# EAGLE schematic power-board (EAGLE 6.6.0)

## Sheet 1 of 18: Headers H1, H2, Solar Panels and Umbilical Connection
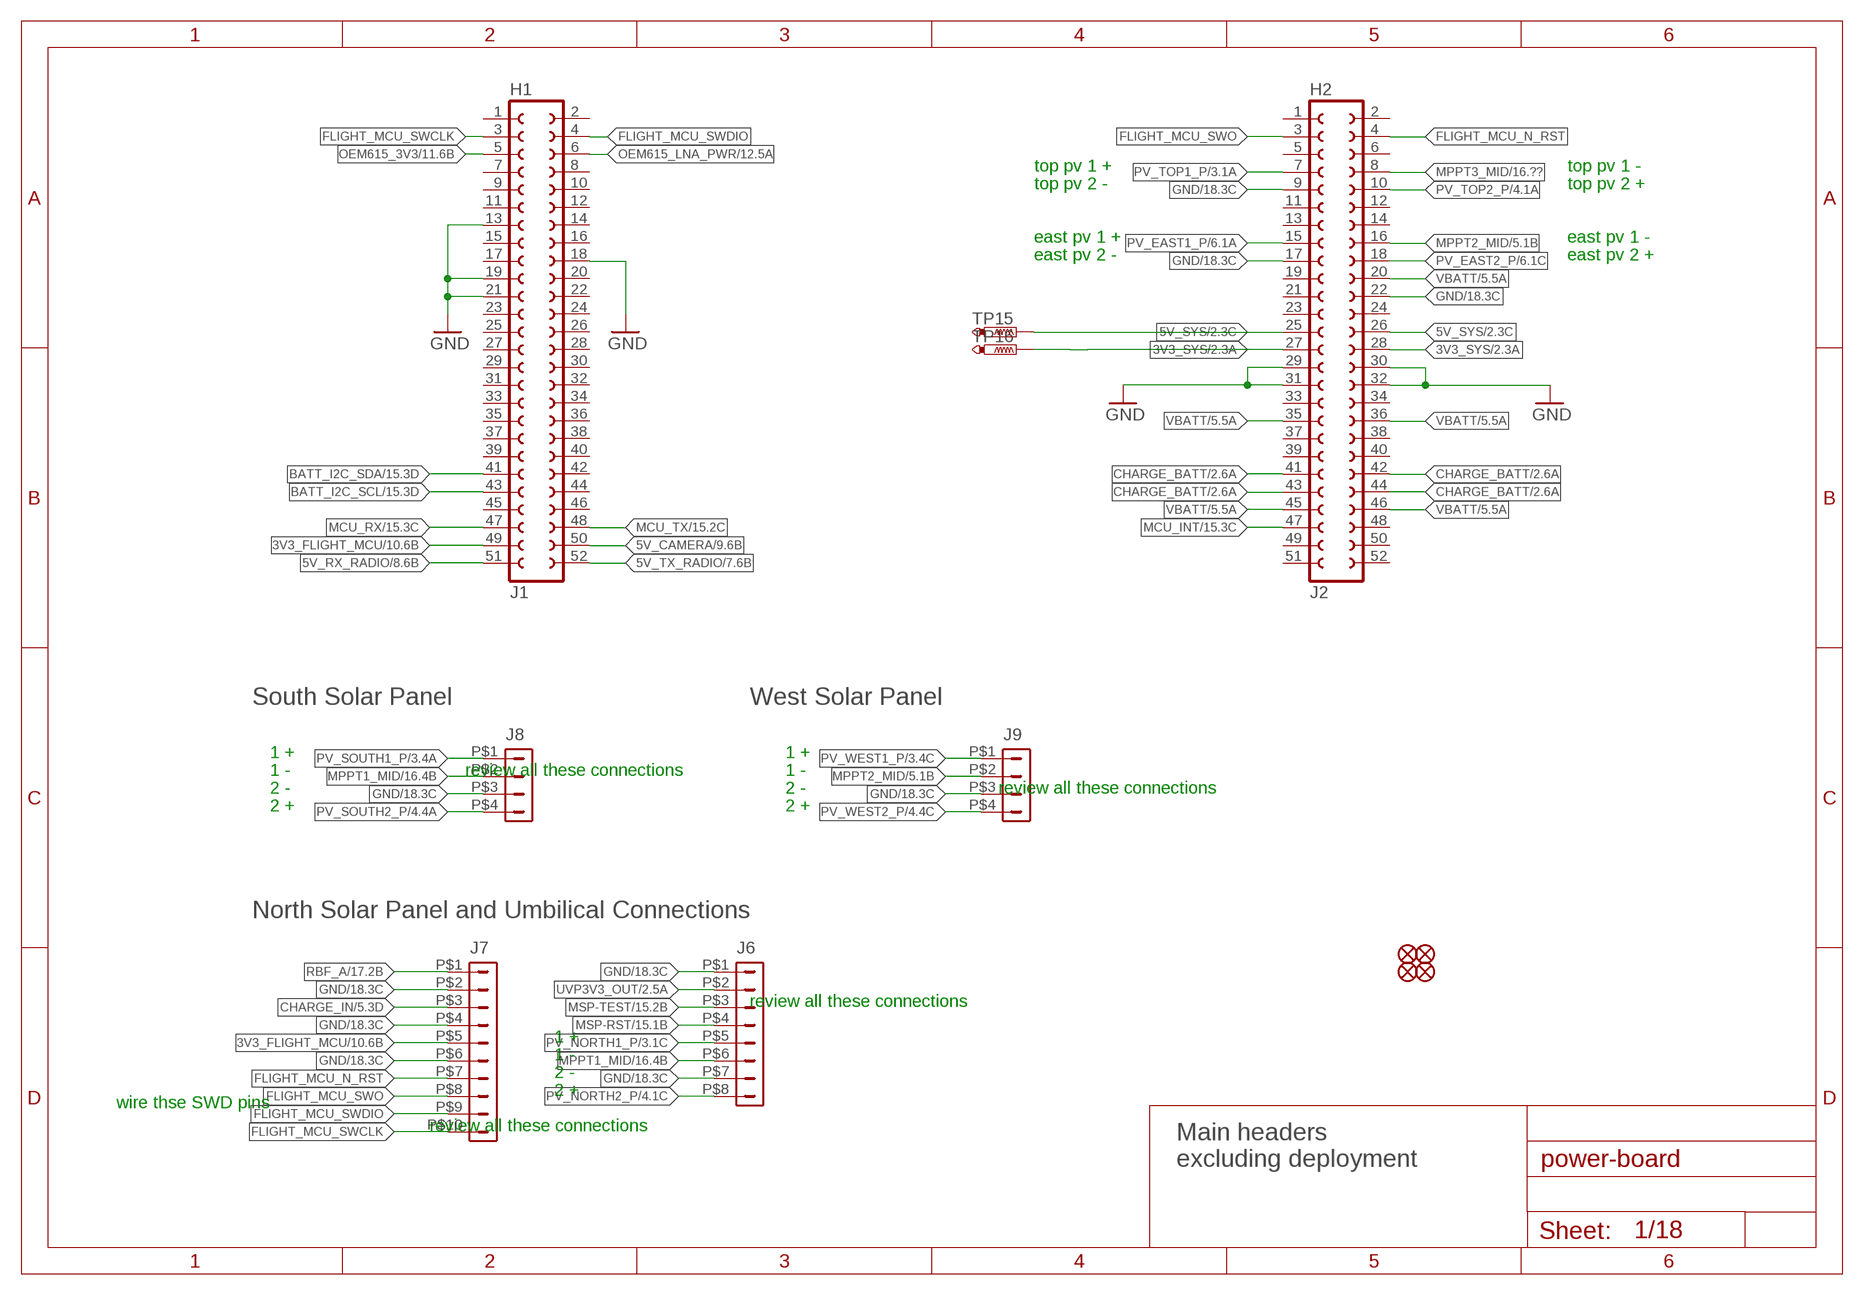
[diagram p0: schematic, sheet 1]

### Parts
FID1  FIDUCIAL1X2-STOP  [FIDUCIAL-1X2-STOP]
FID2  FIDUCIAL1X2-STOP  [FIDUCIAL-1X2-STOP]
FID3  FIDUCIAL1X2-STOP  [FIDUCIAL-1X2-STOP]
FID4  FIDUCIAL1X2-STOP  [FIDUCIAL-1X2-STOP]
J1  H1  FE26-2  [FE26-2]
J2  H2  FE26-2  [FE26-2]
J6  DF13-8P-1.25DS  [DF13-8P-1.25DS]
J7  DF13-10P-1.25DS  [DF13-10P-1.25DS]
J8  DF13-4P-1.25DS  [DF13-4P-1.25DS]
J9  DF13-4P-1.25DS  [DF13-4P-1.25DS]
TP15  PTR1TP09R  [TP09R]
TP16  PTR1TP09R  [TP09R]

### Nets
3V3_FLIGHT_MCU: J1.49 J7.P$5 ; also sheet 10
3V3_SYS: J2.27 J2.28 TP16.TP ; also sheet 2
5V_CAMERA: J1.50 ; also sheet 9
5V_RX_RADIO: J1.51 ; also sheet 8
5V_SYS: J2.25 J2.26 TP15.TP ; also sheet 2
5V_TX_RADIO: J1.52 ; also sheet 7
BATT_I2C_SCL: J1.43 ; also sheet 15
BATT_I2C_SDA: J1.41 ; also sheet 15
CHARGE_BATT: J2.41 J2.42 J2.43 J2.44 ; also sheet 2,18
CHARGE_IN: J7.P$3 ; also sheet 5,16,17,18
FLIGHT_MCU_N_RST: J2.4 J7.P$7
FLIGHT_MCU_SWCLK: J1.3 J7.P$10
FLIGHT_MCU_SWDIO: J1.4 J7.P$9
FLIGHT_MCU_SWO: J2.3 J7.P$8
GND: J1.13 J1.18 J1.19 J1.21 J2.9 J2.17 J2.22 J2.29 J2.30 J2.31 J2.32 J6.P$1 J6.P$7 J7.P$2 J7.P$4 J7.P$6 J8.P$3 J9.P$3 ; also sheet 2,3,4,5,6,7,8,9,10,11,12,13,14,15,16,18
MCU_INT: J2.47 ; also sheet 15
MCU_RX: J1.47 ; also sheet 15
MCU_TX: J1.48 ; also sheet 15
MPPT1_MID: J6.P$6 J8.P$2 ; also sheet 16
MPPT2_MID: J2.16 J9.P$2 ; also sheet 5,16
MPPT3_MID: J2.8 ; also sheet 16
MSP-RST: J6.P$4 ; also sheet 15
MSP-TEST: J6.P$3 ; also sheet 15
OEM615_3V3: J1.5 ; also sheet 11
OEM615_LNA_PWR: J1.6 ; also sheet 12
PV_EAST1_P: J2.15 ; also sheet 6
PV_EAST2_P: J2.18 ; also sheet 6
PV_NORTH1_P: J6.P$5 ; also sheet 3
PV_NORTH2_P: J6.P$8 ; also sheet 4
PV_SOUTH1_P: J8.P$1 ; also sheet 3
PV_SOUTH2_P: J8.P$4 ; also sheet 4
PV_TOP1_P: J2.7 ; also sheet 3
PV_TOP2_P: J2.10 ; also sheet 4
PV_WEST1_P: J9.P$1 ; also sheet 3
PV_WEST2_P: J9.P$4 ; also sheet 4
RBF_A: J7.P$1 ; also sheet 17
UVP3V3_OUT: J6.P$2 ; also sheet 2,3,4,5,6,7,8,9,10,11,12,13,15
VBATT: J2.20 J2.35 J2.36 J2.45 J2.46 ; also sheet 5,7,8,9,10,11,12,13,14,17
Unconnected: J1.1 J1.2 J1.7 J1.8 J1.9 J1.10 J1.11 J1.12 J1.14 J1.15 J1.16 J1.17 J1.20 J1.22 J1.23 J1.24 J1.25 J1.26 J1.27 J1.28 J1.29 J1.30 J1.31 J1.32 J1.33 J1.34 J1.35 J1.36 J1.37 J1.38 J1.39 J1.40 J1.42 J1.44 J1.45 J1.46 J2.1 J2.2 J2.5 J2.6 J2.11 J2.12 J2.13 J2.14 J2.19 J2.21 J2.23 J2.24 J2.33 J2.34 J2.37 J2.38 J2.39 J2.40 J2.48 J2.49 J2.50 J2.51 J2.52

### Notes on the sheet
- top pv 1 + | top pv 1 -
- top pv 2 - | top pv 2 +
- east pv 1 + | east pv 1 -
- east pv 2 - | east pv 2 +
- South Solar Panel | West Solar Panel
- 1 + | 1 +
- 1 - | review all these connections | 1 -
- 2 - | 2 - | review all these connections
- 2 + | 2 +
- North Solar Panel and Umbilical Connections
- review all these connections
- 1 +
- 1 -
- 2 -
- wire thse SWD pins | 2 +
- review all these connections
- Main headers
  excluding deployment

## Sheet 2 of 18: 3V3_SYS/5V_SYS/battery charge Current Sense
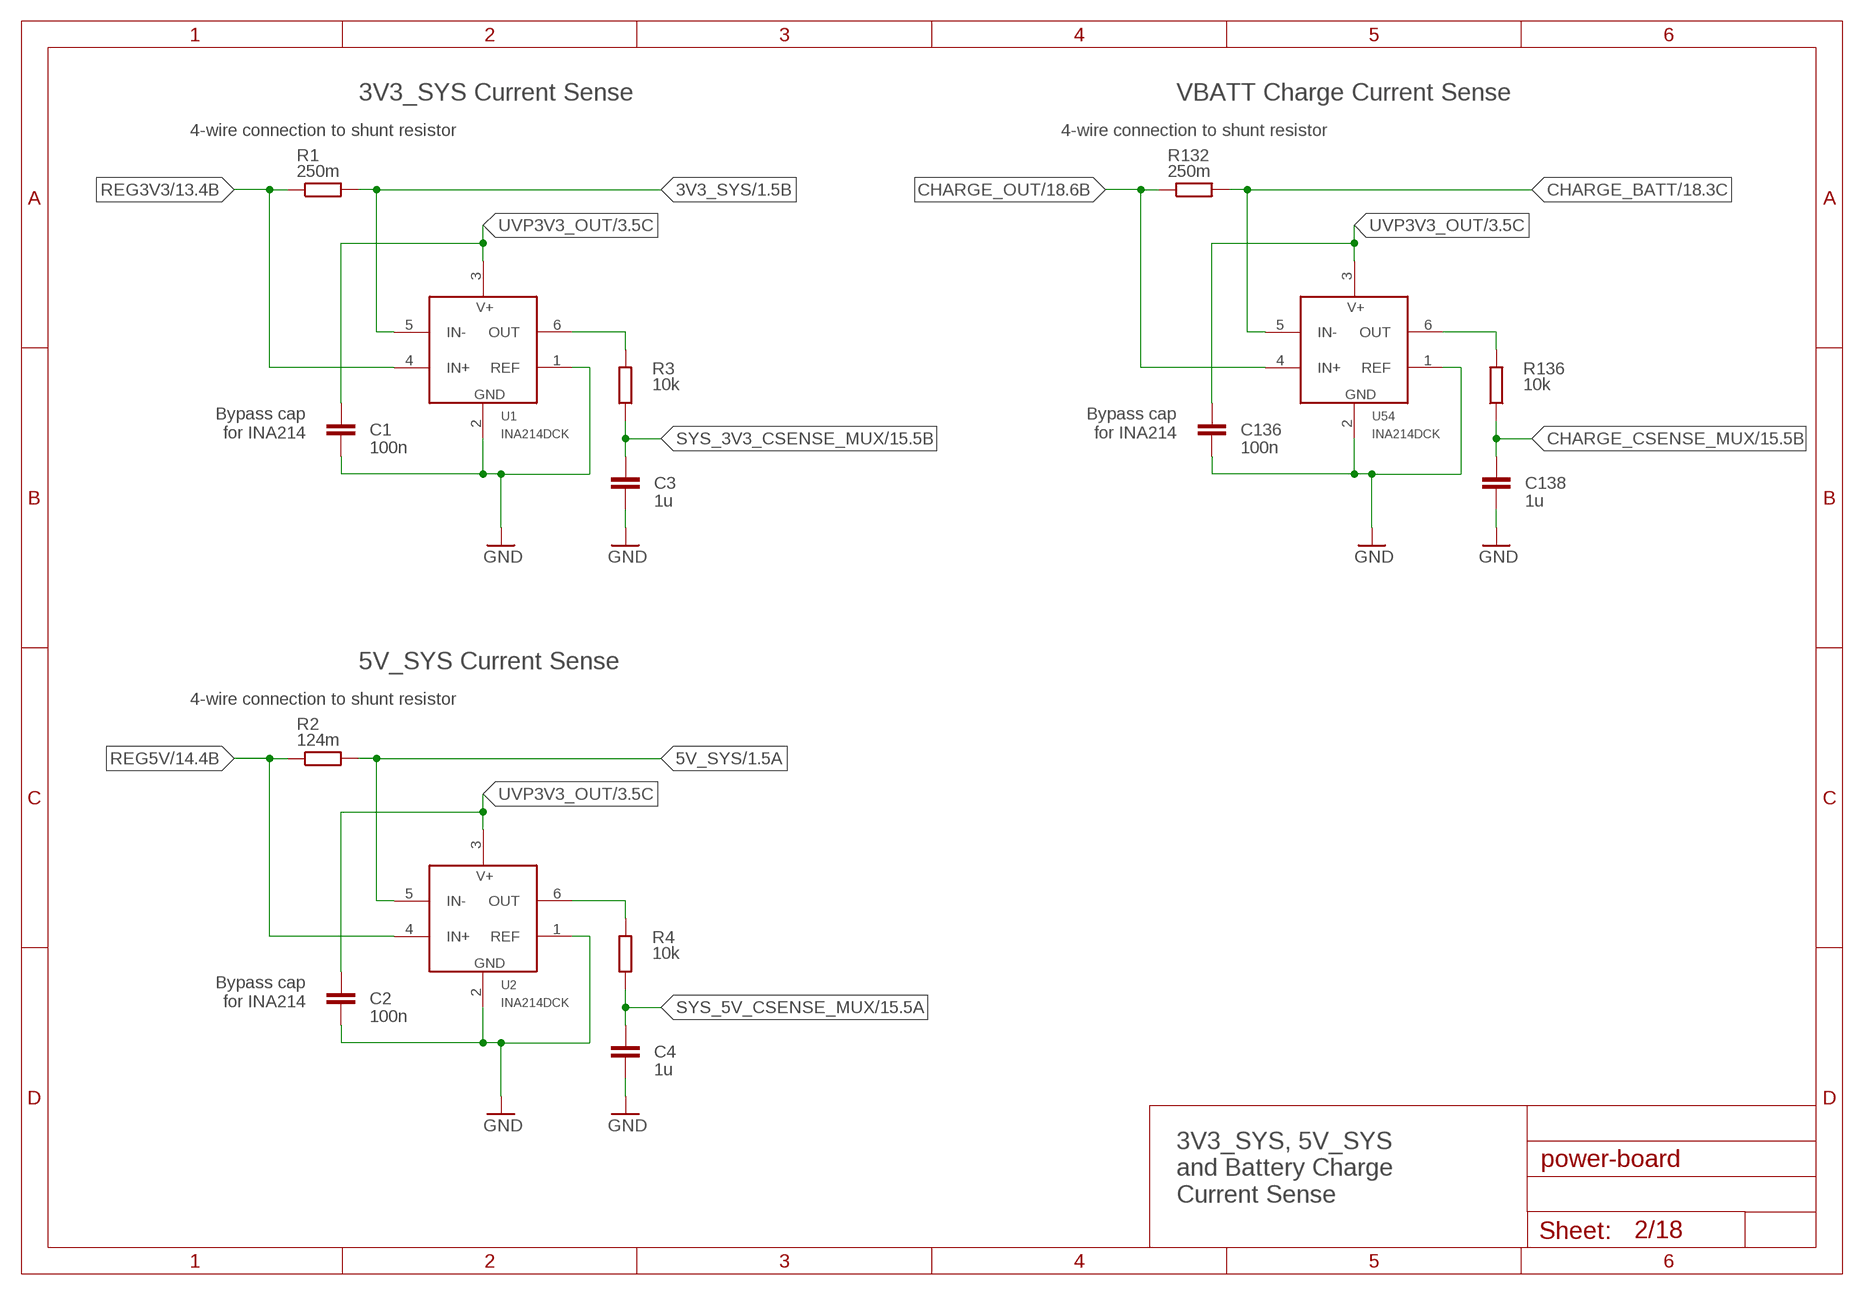
[diagram p1: schematic, sheet 2]

### Parts
C1  100n  C-EUC0603  [C0603]
C2  100n  C-EUC0603  [C0603]
C3  1u  C-EUC0603  [C0603]
C4  1u  C-EUC0603  [C0603]
C136  100n  C-EUC0603  [C0603]
C138  1u  C-EUC0603  [C0603]
R1  250m  R-EU_R1206  [R1206]
R2  124m  R-EU_R1206  [R1206]
R3  10k  R-EU_R0603  [R0603]
R4  10k  R-EU_R0603  [R0603]
R132  250m  R-EU_R1206  [R1206]
R136  10k  R-EU_R0603  [R0603]
U1  INA214DCK  [SC70-6]
U2  INA214DCK  [SC70-6]
U54  INA214DCK  [SC70-6]

### Nets
3V3_SYS: R1.2 U1.5(IN-) ; also sheet 1
5V_SYS: R2.2 U2.5(IN-) ; also sheet 1
CHARGE_BATT: R132.2 U54.5(IN-) ; also sheet 1,18
CHARGE_CSENSE_MUX: C138.1 R136.1 ; also sheet 15
CHARGE_OUT: R132.1 U54.4(IN+) ; also sheet 18
GND: C1.2 C2.2 C3.2 C4.2 C136.2 C138.2 U1.1(REF) U1.2(GND) U2.1(REF) U2.2(GND) U54.1(REF) U54.2(GND) ; also sheet 1,3,4,5,6,7,8,9,10,11,12,13,14,15,16,18
N$81: R3.2 U1.6(OUT)
N$240: R4.2 U2.6(OUT)
N$681: R136.2 U54.6(OUT)
REG3V3: R1.1 U1.4(IN+) ; also sheet 13,14
REG5V: R2.1 U2.4(IN+) ; also sheet 14
SYS_3V3_CSENSE_MUX: C3.1 R3.1 ; also sheet 15
SYS_5V_CSENSE_MUX: C4.1 R4.1 ; also sheet 15
UVP3V3_OUT: C1.1 C2.1 C136.1 U1.3(V+) U2.3(V+) U54.3(V+) ; also sheet 1,3,4,5,6,7,8,9,10,11,12,13,15

### Notes on the sheet
- 3V3_SYS Current Sense | VBATT Charge Current Sense
- 4-wire connection to shunt resistor | 4-wire connection to shunt resistor
- Bypass cap
  for INA214
- Bypass cap
  for INA214
- 5V_SYS Current Sense
- 4-wire connection to shunt resistor
- Bypass cap
  for INA214
- 3V3_SYS, 5V_SYS
  and Battery Charge
  Current Sense

## Sheet 3 of 18: Solar Panel 1 Current Measurements
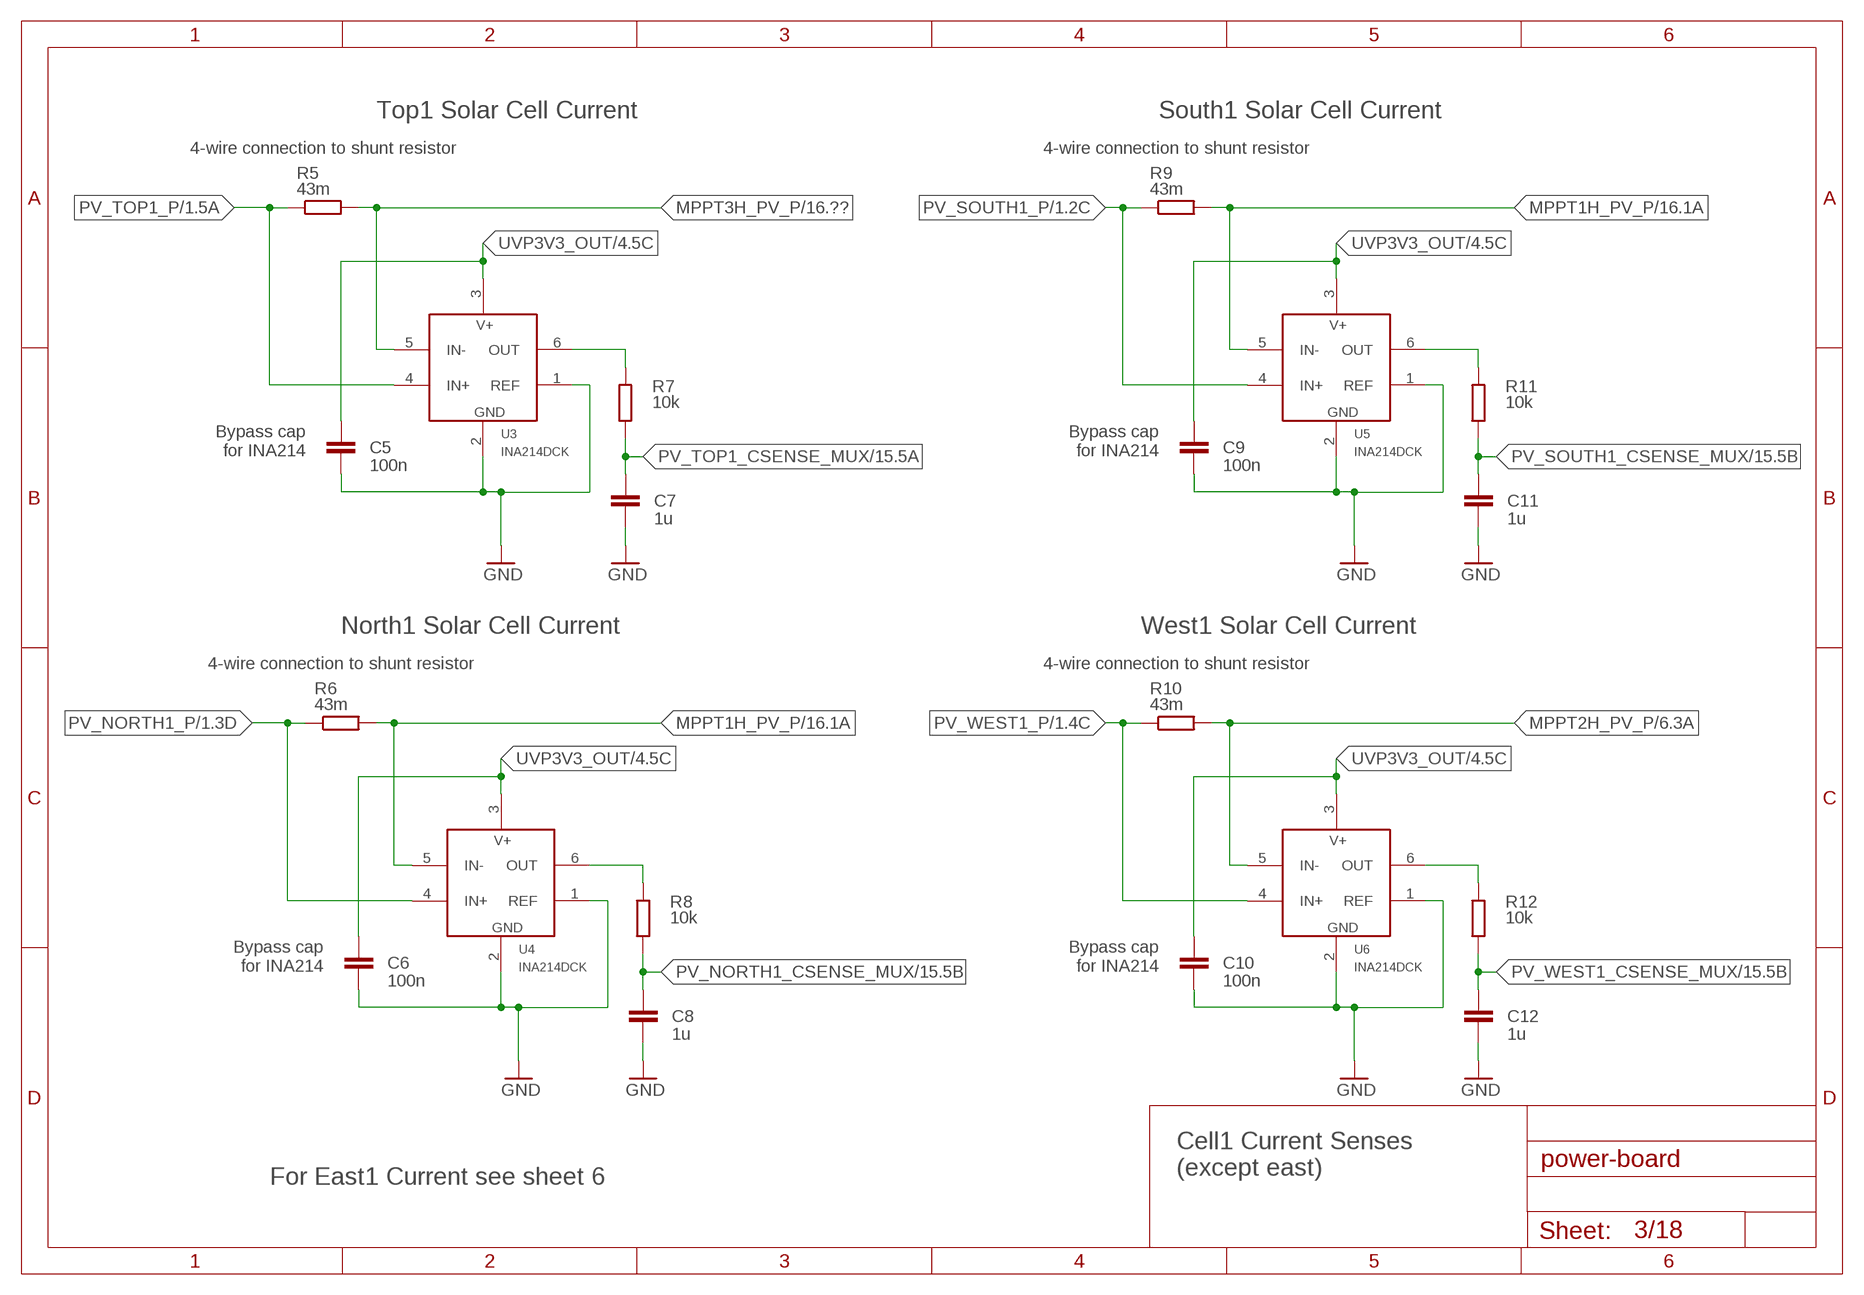
[diagram p2: schematic, sheet 3]

### Parts
C5  100n  C-EUC0603  [C0603]
C6  100n  C-EUC0603  [C0603]
C7  1u  C-EUC0603  [C0603]
C8  1u  C-EUC0603  [C0603]
C9  100n  C-EUC0603  [C0603]
C10  100n  C-EUC0603  [C0603]
C11  1u  C-EUC0603  [C0603]
C12  1u  C-EUC0603  [C0603]
R5  43m  R-EU_R1206  [R1206]
R6  43m  R-EU_R1206  [R1206]
R7  10k  R-EU_R0603  [R0603]
R8  10k  R-EU_R0603  [R0603]
R9  43m  R-EU_R1206  [R1206]
R10  43m  R-EU_R1206  [R1206]
R11  10k  R-EU_R0603  [R0603]
R12  10k  R-EU_R0603  [R0603]
U3  INA214DCK  [SC70-6]
U4  INA214DCK  [SC70-6]
U5  INA214DCK  [SC70-6]
U6  INA214DCK  [SC70-6]

### Nets
GND: C5.2 C6.2 C7.2 C8.2 C9.2 C10.2 C11.2 C12.2 U3.1(REF) U3.2(GND) U4.1(REF) U4.2(GND) U5.1(REF) U5.2(GND) U6.1(REF) U6.2(GND) ; also sheet 1,2,4,5,6,7,8,9,10,11,12,13,14,15,16,18
MPPT1H_PV_P: R6.2 R9.2 U4.5(IN-) U5.5(IN-) ; also sheet 16
MPPT2H_PV_P: R10.2 U6.5(IN-) ; also sheet 6,16
MPPT3H_PV_P: R5.2 U3.5(IN-) ; also sheet 16
N$93: R7.2 U3.6(OUT)
N$96: R11.2 U5.6(OUT)
N$279: R8.2 U4.6(OUT)
N$570: R12.2 U6.6(OUT)
PV_NORTH1_CSENSE_MUX: C8.1 R8.1 ; also sheet 15
PV_NORTH1_P: R6.1 U4.4(IN+) ; also sheet 1
PV_SOUTH1_CSENSE_MUX: C11.1 R11.1 ; also sheet 15
PV_SOUTH1_P: R9.1 U5.4(IN+) ; also sheet 1
PV_TOP1_CSENSE_MUX: C7.1 R7.1 ; also sheet 15
PV_TOP1_P: R5.1 U3.4(IN+) ; also sheet 1
PV_WEST1_CSENSE_MUX: C12.1 R12.1 ; also sheet 15
PV_WEST1_P: R10.1 U6.4(IN+) ; also sheet 1
UVP3V3_OUT: C5.1 C6.1 C9.1 C10.1 U3.3(V+) U4.3(V+) U5.3(V+) U6.3(V+) ; also sheet 1,2,4,5,6,7,8,9,10,11,12,13,15

### Notes on the sheet
- Top1 Solar Cell Current | South1 Solar Cell Current
- 4-wire connection to shunt resistor | 4-wire connection to shunt resistor
- Bypass cap
  for INA214
- Bypass cap
  for INA214
- North1 Solar Cell Current | West1 Solar Cell Current
- 4-wire connection to shunt resistor | 4-wire connection to shunt resistor
- Bypass cap
  for INA214
- Bypass cap
  for INA214
- Cell1 Current Senses
  (except east)
- For East1 Current see sheet 6

## Sheet 4 of 18: Solar Panel 2 Current Measurements
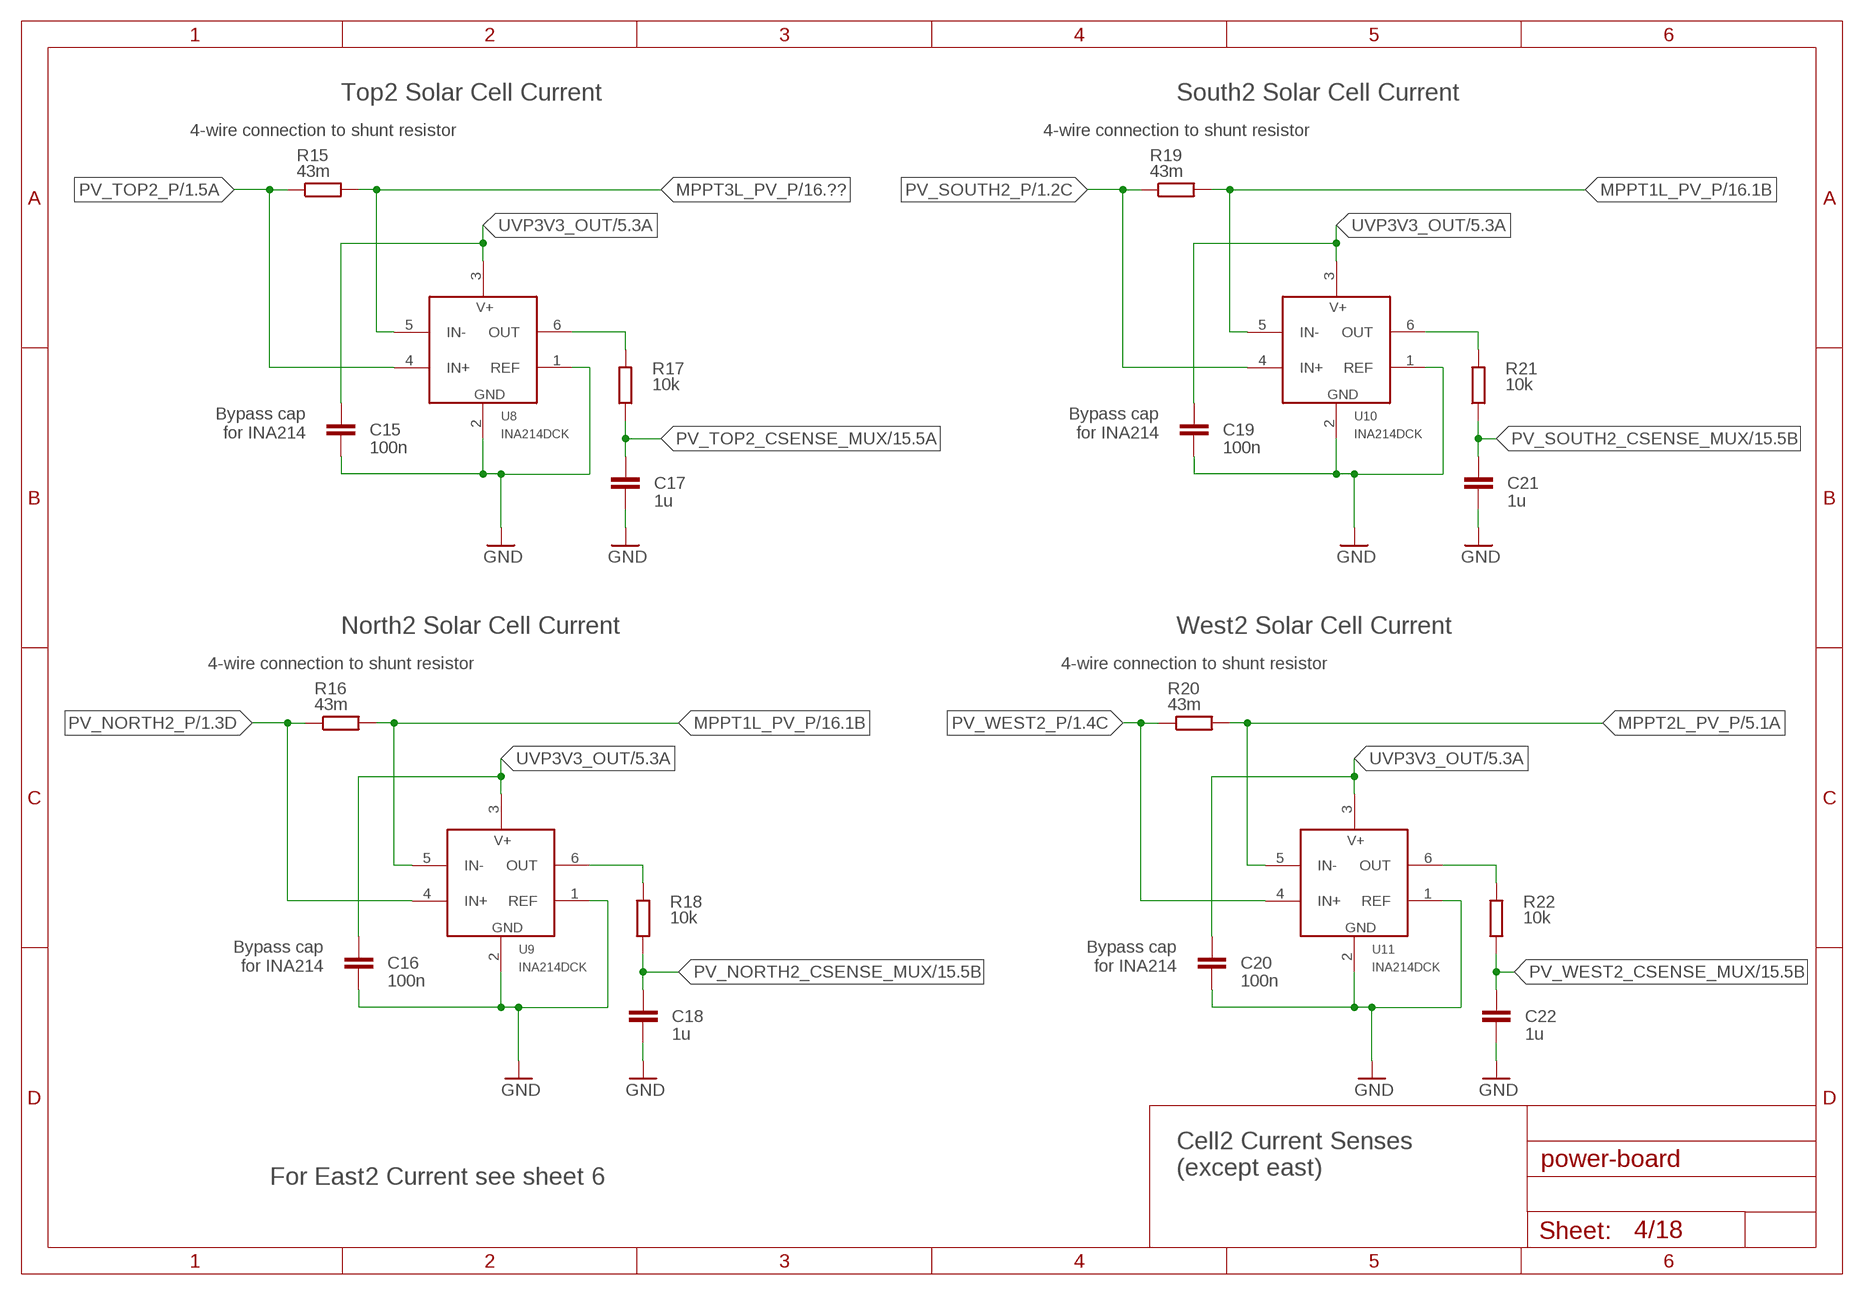
[diagram p3: schematic, sheet 4]

### Parts
C15  100n  C-EUC0603  [C0603]
C16  100n  C-EUC0603  [C0603]
C17  1u  C-EUC0603  [C0603]
C18  1u  C-EUC0603  [C0603]
C19  100n  C-EUC0603  [C0603]
C20  100n  C-EUC0603  [C0603]
C21  1u  C-EUC0603  [C0603]
C22  1u  C-EUC0603  [C0603]
R15  43m  R-EU_R1206  [R1206]
R16  43m  R-EU_R1206  [R1206]
R17  10k  R-EU_R0603  [R0603]
R18  10k  R-EU_R0603  [R0603]
R19  43m  R-EU_R1206  [R1206]
R20  43m  R-EU_R1206  [R1206]
R21  10k  R-EU_R0603  [R0603]
R22  10k  R-EU_R0603  [R0603]
U8  INA214DCK  [SC70-6]
U9  INA214DCK  [SC70-6]
U10  INA214DCK  [SC70-6]
U11  INA214DCK  [SC70-6]

### Nets
GND: C15.2 C16.2 C17.2 C18.2 C19.2 C20.2 C21.2 C22.2 U8.1(REF) U8.2(GND) U9.1(REF) U9.2(GND) U10.1(REF) U10.2(GND) U11.1(REF) U11.2(GND) ; also sheet 1,2,3,5,6,7,8,9,10,11,12,13,14,15,16,18
MPPT1L_PV_P: R16.2 R19.2 U9.5(IN-) U10.5(IN-) ; also sheet 16
MPPT2L_PV_P: R20.2 U11.5(IN-) ; also sheet 5,6,16
MPPT3L_PV_P: R15.2 U8.5(IN-) ; also sheet 16
N$15: R17.2 U8.6(OUT)
N$53: R21.2 U10.6(OUT)
N$644: R18.2 U9.6(OUT)
N$682: R22.2 U11.6(OUT)
PV_NORTH2_CSENSE_MUX: C18.1 R18.1 ; also sheet 15
PV_NORTH2_P: R16.1 U9.4(IN+) ; also sheet 1
PV_SOUTH2_CSENSE_MUX: C21.1 R21.1 ; also sheet 15
PV_SOUTH2_P: R19.1 U10.4(IN+) ; also sheet 1
PV_TOP2_CSENSE_MUX: C17.1 R17.1 ; also sheet 15
PV_TOP2_P: R15.1 U8.4(IN+) ; also sheet 1
PV_WEST2_CSENSE_MUX: C22.1 R22.1 ; also sheet 15
PV_WEST2_P: R20.1 U11.4(IN+) ; also sheet 1
UVP3V3_OUT: C15.1 C16.1 C19.1 C20.1 U8.3(V+) U9.3(V+) U10.3(V+) U11.3(V+) ; also sheet 1,2,3,5,6,7,8,9,10,11,12,13,15

### Notes on the sheet
- Top2 Solar Cell Current | South2 Solar Cell Current
- 4-wire connection to shunt resistor | 4-wire connection to shunt resistor
- Bypass cap
  for INA214
- Bypass cap
  for INA214
- North2 Solar Cell Current | West2 Solar Cell Current
- 4-wire connection to shunt resistor | 4-wire connection to shunt resistor
- Bypass cap
  for INA214
- Bypass cap
  for INA214
- Cell2 Current Senses
  (except east)
- For East2 Current see sheet 6

## Sheet 5 of 18: Voltage Measurements
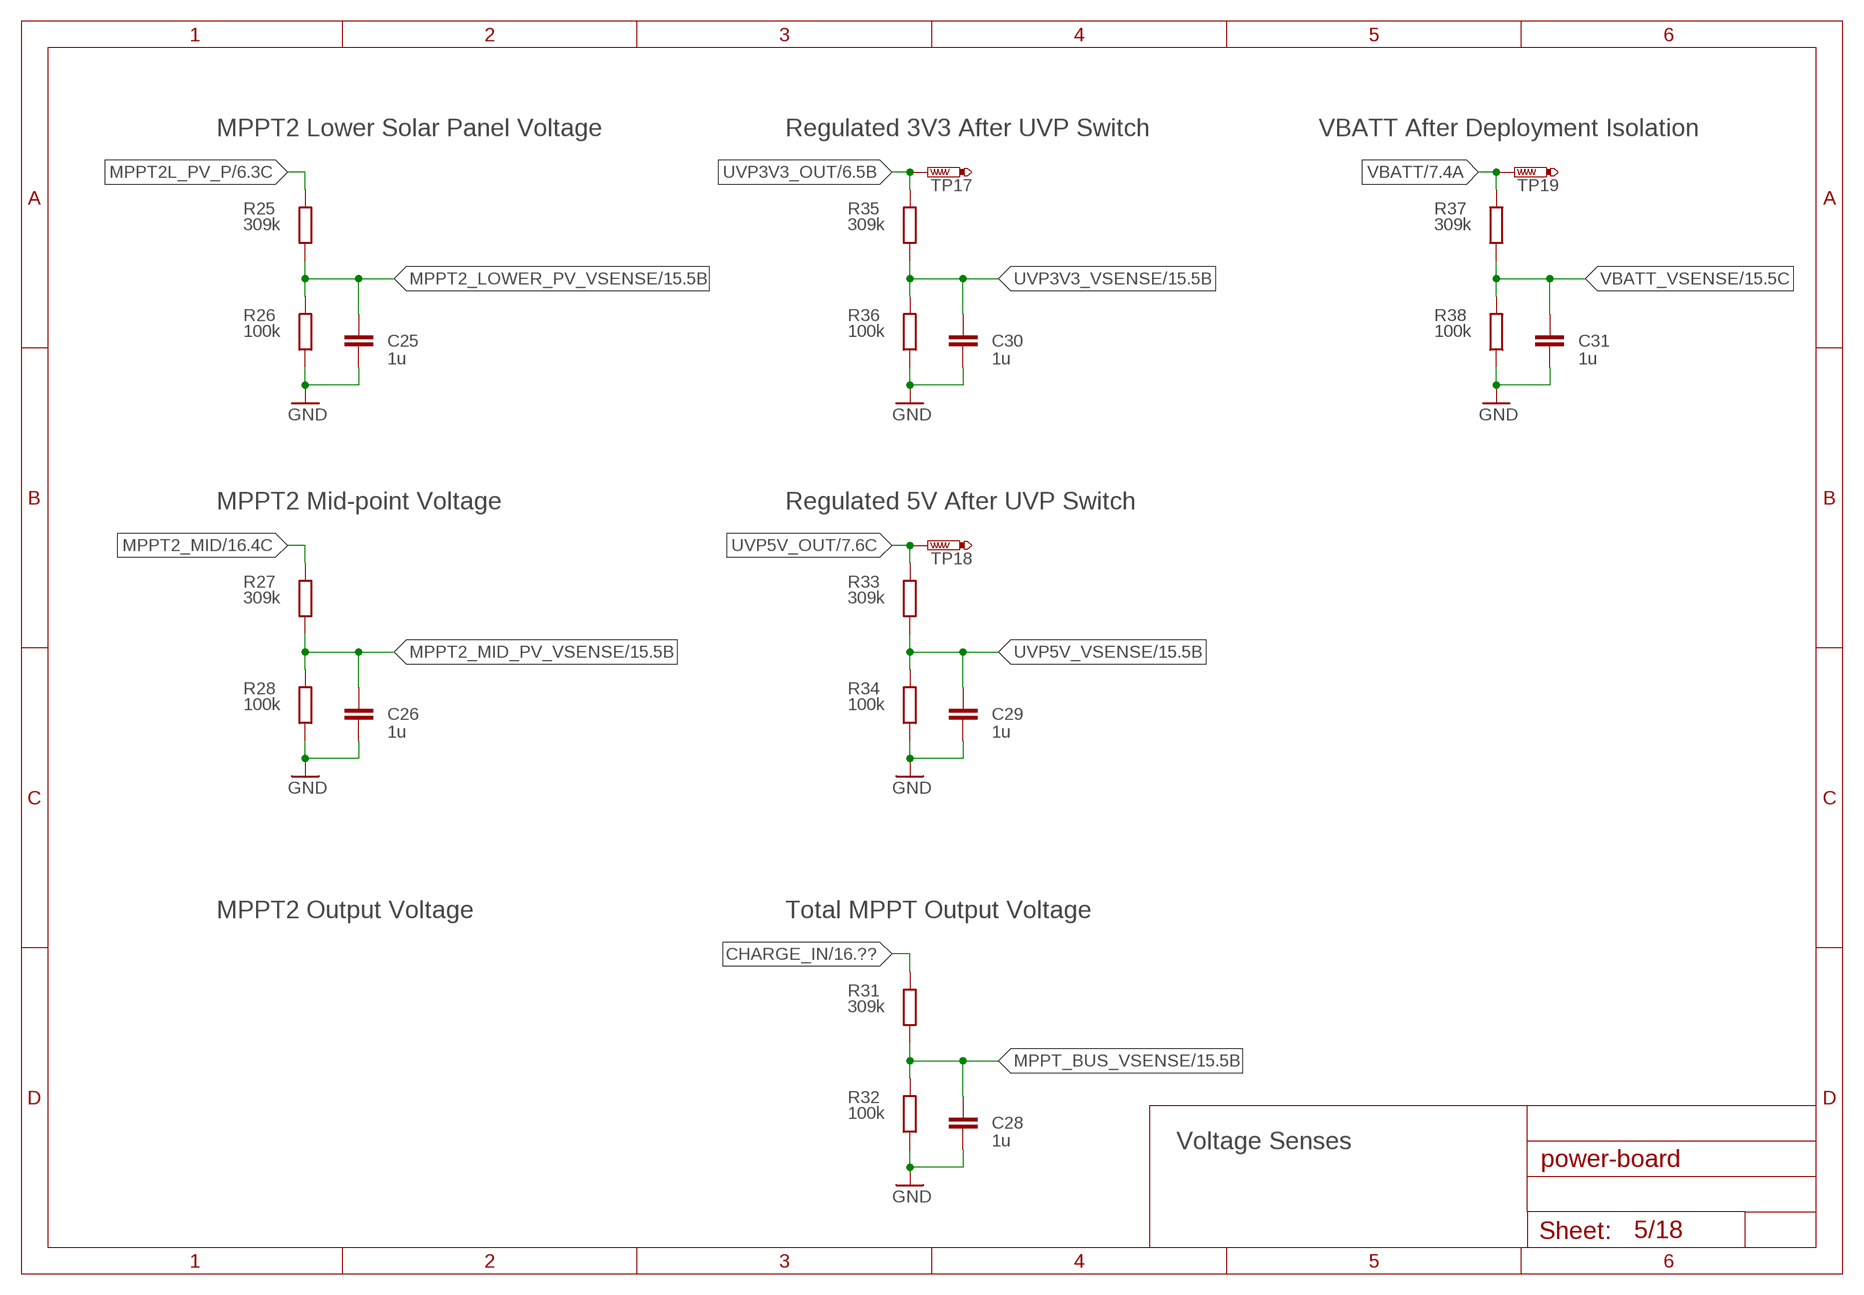
[diagram p4: schematic, sheet 5]

### Parts
C25  1u  C-EUC0603  [C0603]
C26  1u  C-EUC0603  [C0603]
C28  1u  C-EUC0603  [C0603]
C29  1u  C-EUC0603  [C0603]
C30  1u  C-EUC0603  [C0603]
C31  1u  C-EUC0603  [C0603]
R25  309k  R-EU_R0603  [R0603]
R26  100k  R-EU_R0603  [R0603]
R27  309k  R-EU_R0603  [R0603]
R28  100k  R-EU_R0603  [R0603]
R31  309k  R-EU_R0603  [R0603]
R32  100k  R-EU_R0603  [R0603]
R33  309k  R-EU_R0603  [R0603]
R34  100k  R-EU_R0603  [R0603]
R35  309k  R-EU_R0603  [R0603]
R36  100k  R-EU_R0603  [R0603]
R37  309k  R-EU_R0603  [R0603]
R38  100k  R-EU_R0603  [R0603]
TP17  PTR1TP09R  [TP09R]
TP18  PTR1TP09R  [TP09R]
TP19  PTR1TP09R  [TP09R]

### Nets
CHARGE_IN: R31.2 ; also sheet 1,16,17,18
GND: C25.2 C26.2 C28.2 C29.2 C30.2 C31.2 R26.1 R28.1 R32.1 R34.1 R36.1 R38.1 ; also sheet 1,2,3,4,6,7,8,9,10,11,12,13,14,15,16,18
MPPT2_LOWER_PV_VSENSE: C25.1 R25.1 R26.2 ; also sheet 15
MPPT2_MID: R27.2 ; also sheet 1,16
MPPT2_MID_PV_VSENSE: C26.1 R27.1 R28.2 ; also sheet 15
MPPT2L_PV_P: R25.2 ; also sheet 4,6,16
MPPT_BUS_VSENSE: C28.1 R31.1 R32.2 ; also sheet 15
UVP3V3_OUT: R35.2 TP17.TP ; also sheet 1,2,3,4,6,7,8,9,10,11,12,13,15
UVP3V3_VSENSE: C30.1 R35.1 R36.2 ; also sheet 15
UVP5V_OUT: R33.2 TP18.TP ; also sheet 7,8,9,14
UVP5V_VSENSE: C29.1 R33.1 R34.2 ; also sheet 15
VBATT: R37.2 TP19.TP ; also sheet 1,7,8,9,10,11,12,13,14,17
VBATT_VSENSE: C31.1 R37.1 R38.2 ; also sheet 15

### Notes on the sheet
- MPPT2 Lower Solar Panel Voltage | Regulated 3V3 After UVP Switch | VBATT After Deployment Isolation
- MPPT2 Mid-point Voltage | Regulated 5V After UVP Switch
- MPPT2 Output Voltage | Total MPPT Output Voltage
- Voltage Senses

## Sheet 6 of 18: OCP Comparator Reference and East solar panel current sense
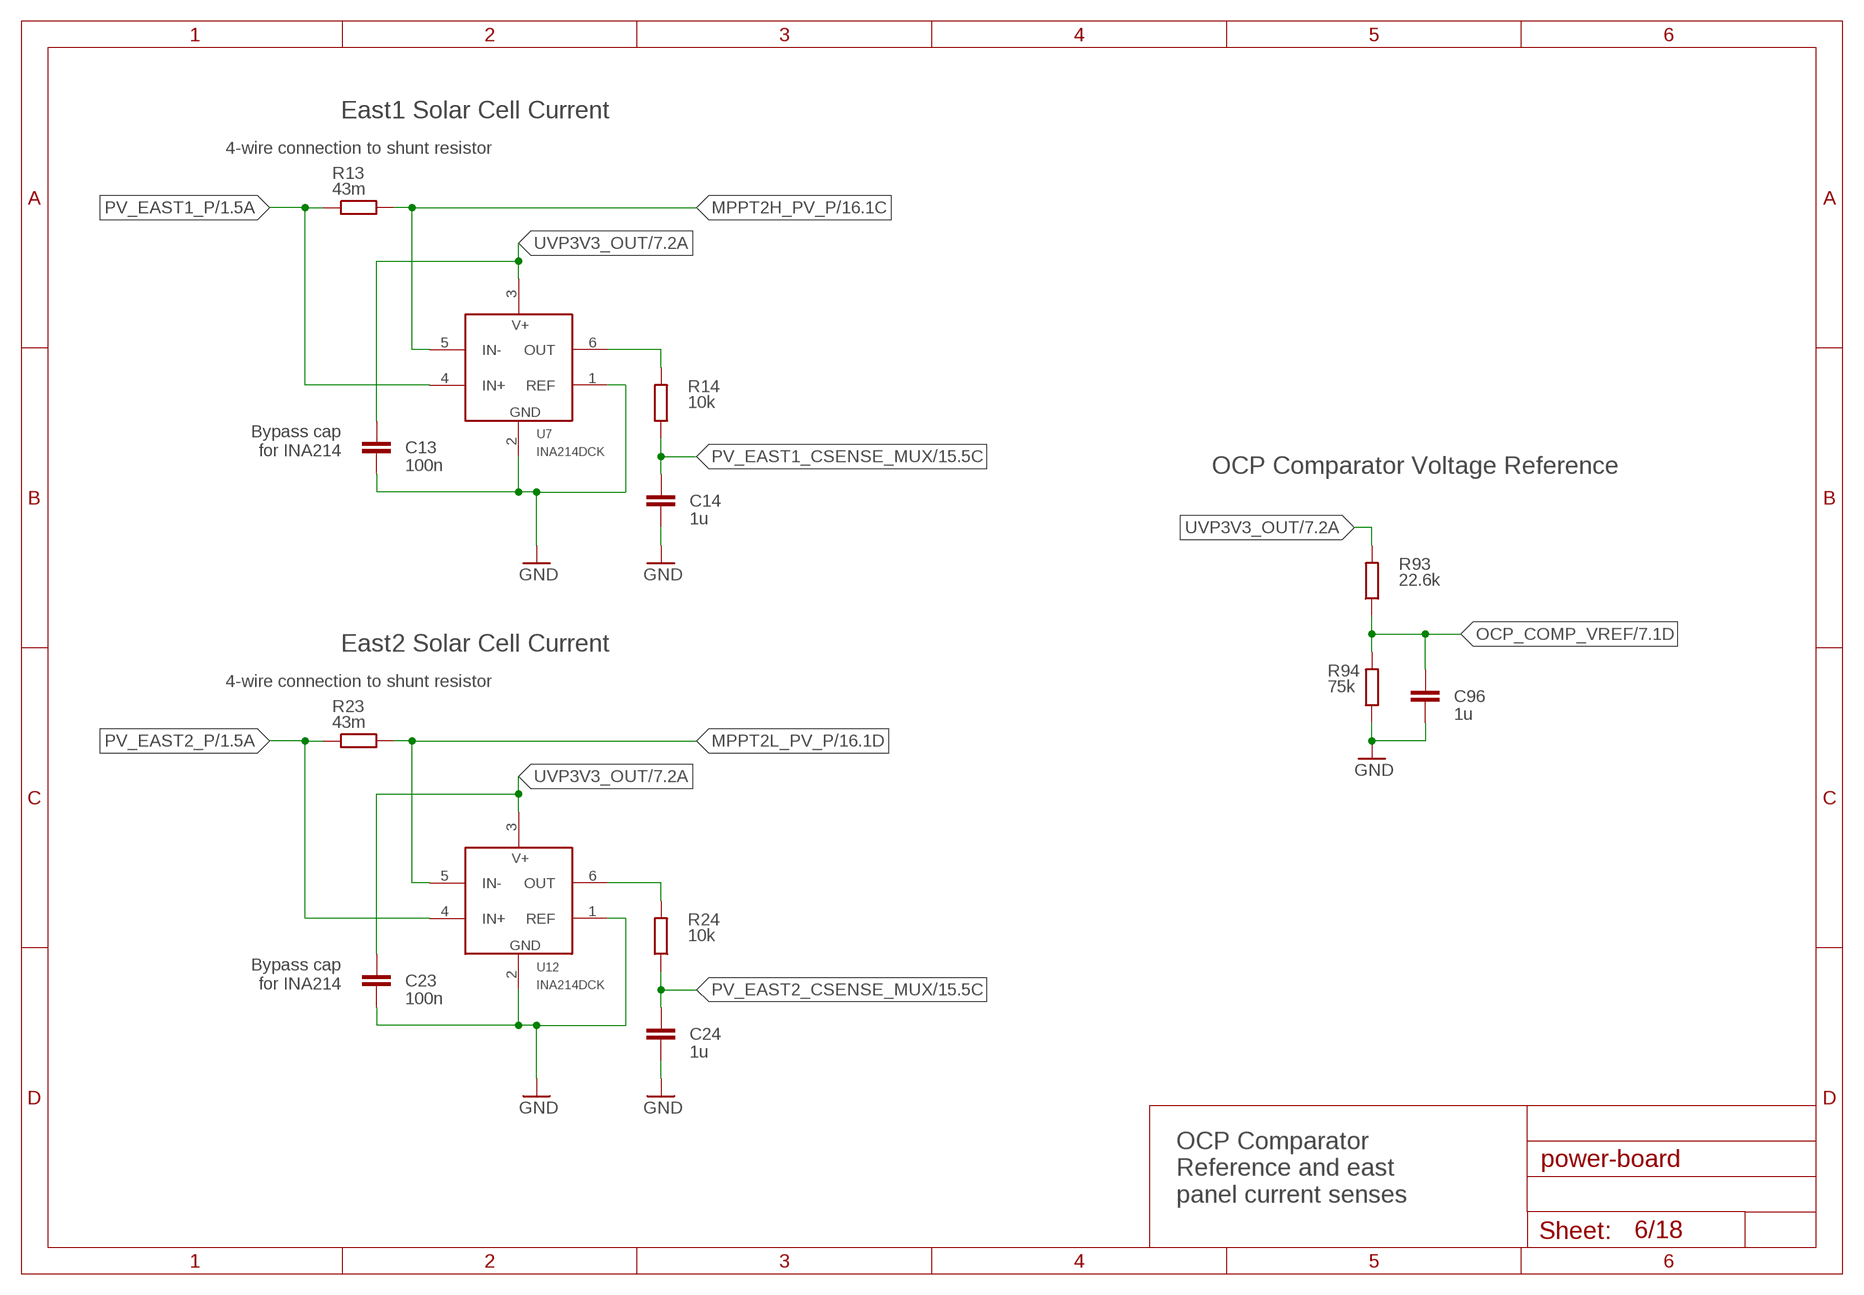
[diagram p5: schematic, sheet 6]

### Parts
C13  100n  C-EUC0603  [C0603]
C14  1u  C-EUC0603  [C0603]
C23  100n  C-EUC0603  [C0603]
C24  1u  C-EUC0603  [C0603]
C96  1u  C-EUC0603  [C0603]
R13  43m  R-EU_R1206  [R1206]
R14  10k  R-EU_R0603  [R0603]
R23  43m  R-EU_R1206  [R1206]
R24  10k  R-EU_R0603  [R0603]
R93  22.6k  R-EU_R0603  [R0603]
R94  75k  R-EU_R0603  [R0603]
U7  INA214DCK  [SC70-6]
U12  INA214DCK  [SC70-6]

### Nets
GND: C13.2 C14.2 C23.2 C24.2 C96.2 R94.1 U7.1(REF) U7.2(GND) U12.1(REF) U12.2(GND) ; also sheet 1,2,3,4,5,7,8,9,10,11,12,13,14,15,16,18
MPPT2H_PV_P: R13.2 U7.5(IN-) ; also sheet 3,16
MPPT2L_PV_P: R23.2 U12.5(IN-) ; also sheet 4,5,16
N$607: R14.2 U7.6(OUT)
N$719: R24.2 U12.6(OUT)
OCP_COMP_VREF: C96.1 R93.1 R94.2 ; also sheet 7,8,9,10,11,12
PV_EAST1_CSENSE_MUX: C14.1 R14.1 ; also sheet 15
PV_EAST1_P: R13.1 U7.4(IN+) ; also sheet 1
PV_EAST2_CSENSE_MUX: C24.1 R24.1 ; also sheet 15
PV_EAST2_P: R23.1 U12.4(IN+) ; also sheet 1
UVP3V3_OUT: C13.1 C23.1 R93.2 U7.3(V+) U12.3(V+) ; also sheet 1,2,3,4,5,7,8,9,10,11,12,13,15

### Notes on the sheet
- East1 Solar Cell Current
- 4-wire connection to shunt resistor
- Bypass cap
  for INA214
- OCP Comparator Voltage Reference
- East2 Solar Cell Current
- 4-wire connection to shunt resistor
- Bypass cap
  for INA214
- OCP Comparator
  Reference and east
  panel current senses

## Sheet 7 of 18: OCP1 5V_TX_RADIO
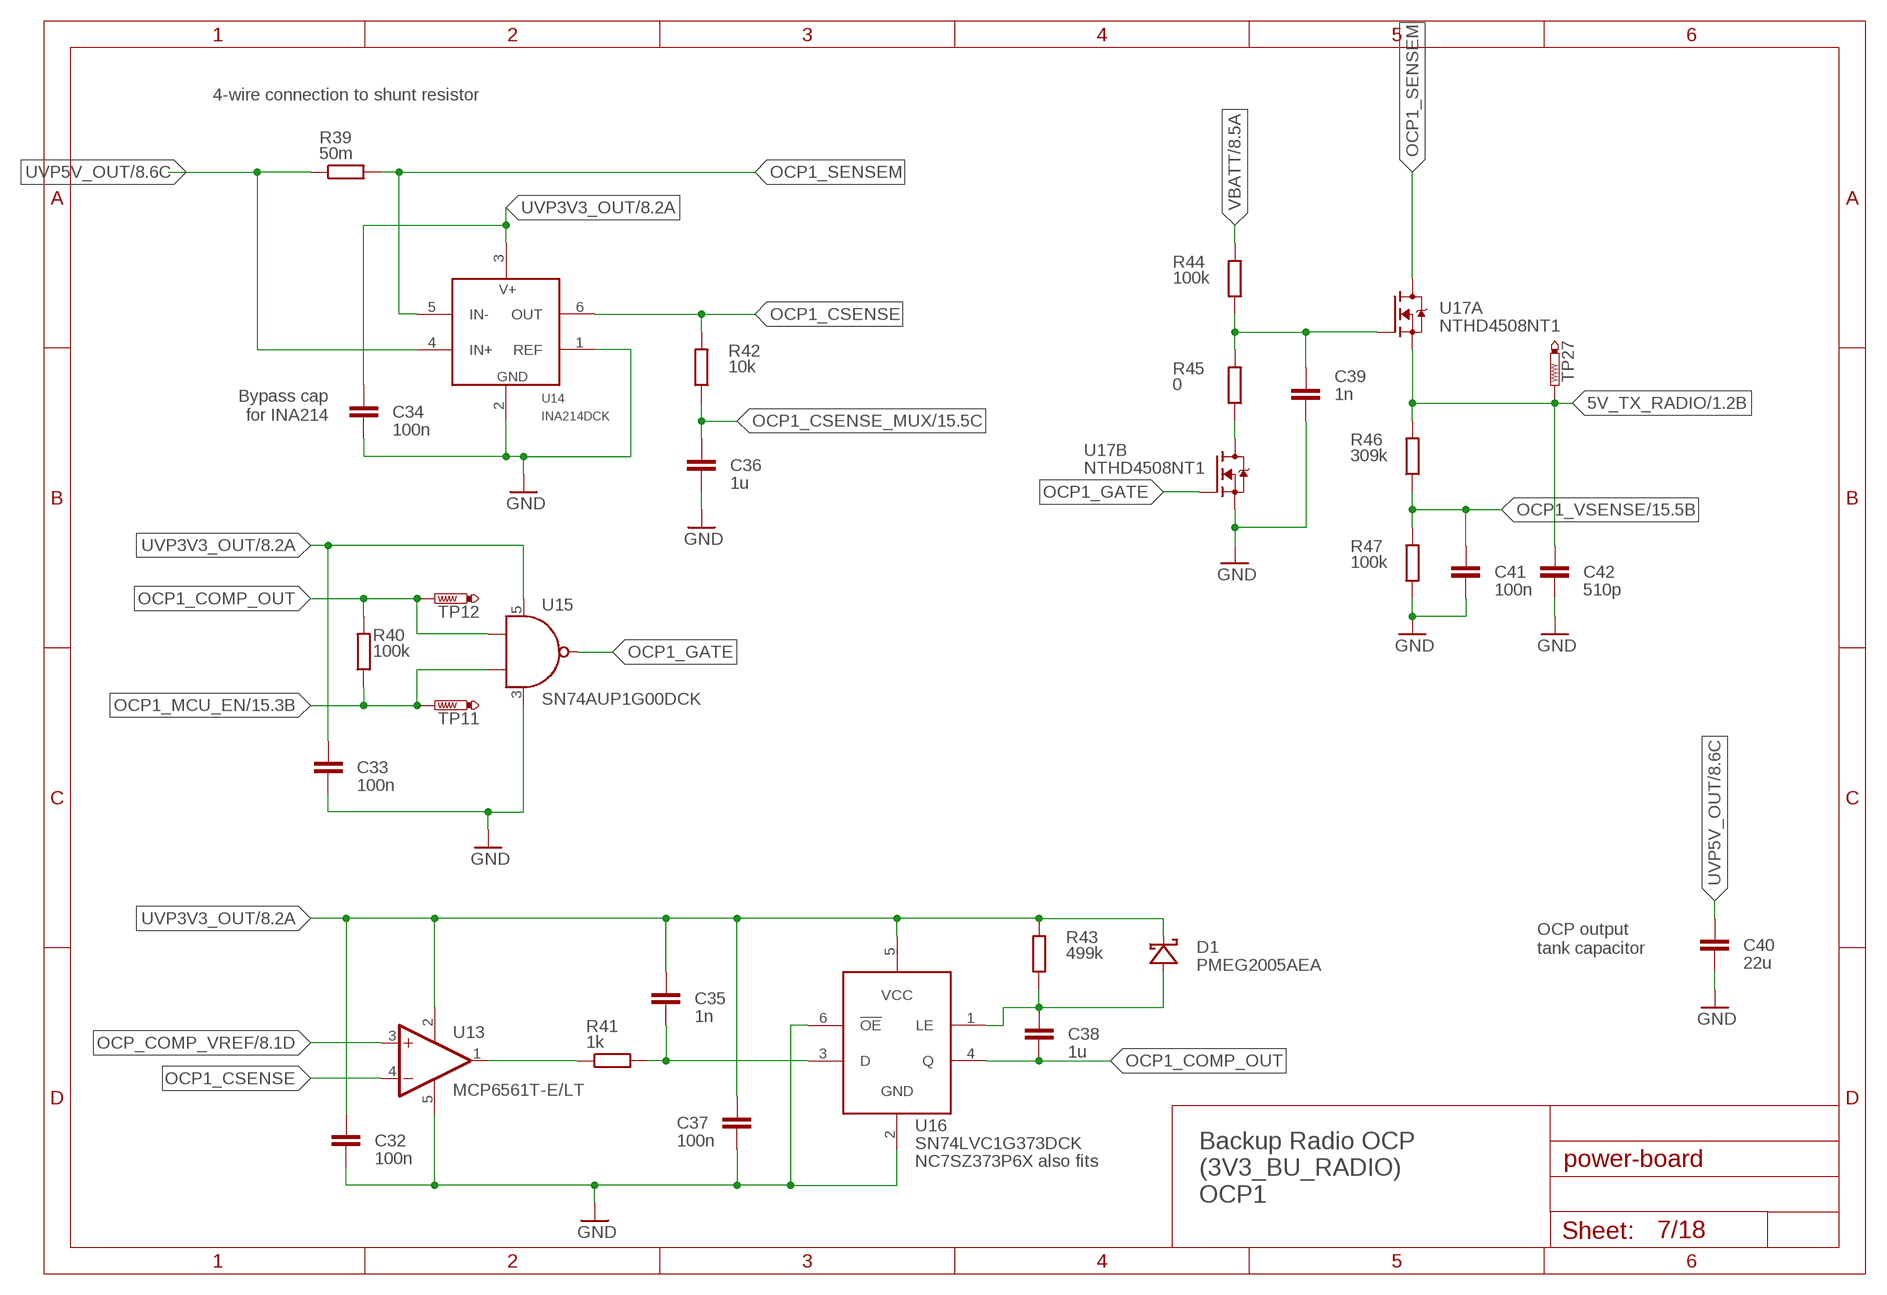
[diagram p6: schematic, sheet 7]

### Parts
C32  100n  C-EUC0603  [C0603]
C33  100n  C-EUC0603  [C0603]
C34  100n  C-EUC0603  [C0603]
C35  1n  C-EUC0603  [C0603]
C36  1u  C-EUC0603  [C0603]
C37  100n  C-EUC0603  [C0603]
C38  1u  C-EUC0603  [C0603]
C39  1n  C-EUC0603  [C0603]
C40  22u  C-EUC1210  [C1210]
C41  100n  C-EUC0603  [C0603]
C42  510p  C-EUC0603  [C0603]
D1  PMEG2005AEA  [SOD-323]
R39  50m  R-EU_R1206  [R1206]
R40  100k  R-EU_R0603  [R0603]
R41  1k  R-EU_R0603  [R0603]
R42  10k  R-EU_R0603  [R0603]
R43  499k  R-EU_R0603  [R0603]
R44  100k  R-EU_R0603  [R0603]
R45  0  R-EU_R0603  [R0603]
R46  309k  R-EU_R0603  [R0603]
R47  100k  R-EU_R0603  [R0603]
TP11  PTR1TP09R  [TP09R]
TP12  PTR1TP09R  [TP09R]
TP27  PTR1TP09R  [TP09R]
U13  MCP6561T-E/LT  [SOT23-5]
U14  INA214DCK  [SC70-6]
U15  SN74AUP1G00DCK  [SC70-5]
U16  SN74LVC1G373DCK  [SC70-6]
U17  NTHD4508NT1  [CHIPFET-1206A-S2]

### Nets
5V_TX_RADIO: C42.1 R46.2 TP27.TP U17.1(A:S) ; also sheet 1
GND: C32.2 C33.2 C34.2 C36.2 C37.2 C39.2 C40.2 C41.2 C42.2 R47.1 U13.5(V-) U14.1(REF) U14.2(GND) U15.3(V-) U16.2(GND) U16.6(!OE) U17.3(B:S) ; also sheet 1,2,3,4,5,6,8,9,10,11,12,13,14,15,16,18
N$2: C39.1 R44.1 R45.2 U17.2(A:G)
N$42: R45.1 U17.5(B:D) U17.6(B:D)
N$55: C35.1 R41.2 U16.3(D)
N$56: R41.1 U13.1(OUT)
N$57: C38.1 D1.2(A) R43.1 U16.1(LE)
OCP1_COMP_OUT: C38.2 R40.2 TP12.TP U15.1(A) U16.4(Q)
OCP1_CSENSE: R42.2 U13.4(-IN) U14.6(OUT)
OCP1_CSENSE_MUX: C36.1 R42.1 ; also sheet 15
OCP1_GATE: U15.4(Y) U17.4(B:G)
OCP1_MCU_EN: R40.1 TP11.TP U15.2(B) ; also sheet 15
OCP1_SENSEM: R39.2 U14.5(IN-) U17.7(A:D) U17.8(A:D)
OCP1_VSENSE: C41.1 R46.1 R47.2 ; also sheet 15
OCP_COMP_VREF: U13.3(+IN) ; also sheet 6,8,9,10,11,12
UVP3V3_OUT: C32.1 C33.1 C34.1 C35.2 C37.1 D1.1(C) R43.2 U13.2(V+) U14.3(V+) U15.5(V+) U16.5(VCC) ; also sheet 1,2,3,4,5,6,8,9,10,11,12,13,15
UVP5V_OUT: C40.1 R39.1 U14.4(IN+) ; also sheet 5,8,9,14
VBATT: R44.2 ; also sheet 1,5,8,9,10,11,12,13,14,17

### Notes on the sheet
- 4-wire connection to shunt resistor
- Bypass cap
  for INA214
- OCP output
  tank capacitor
- Backup Radio OCP
  (3V3_BU_RADIO)
  OCP1
- NC7SZ373P6X also fits

## Sheet 8 of 18: OCP2 5V_RX_RADIO
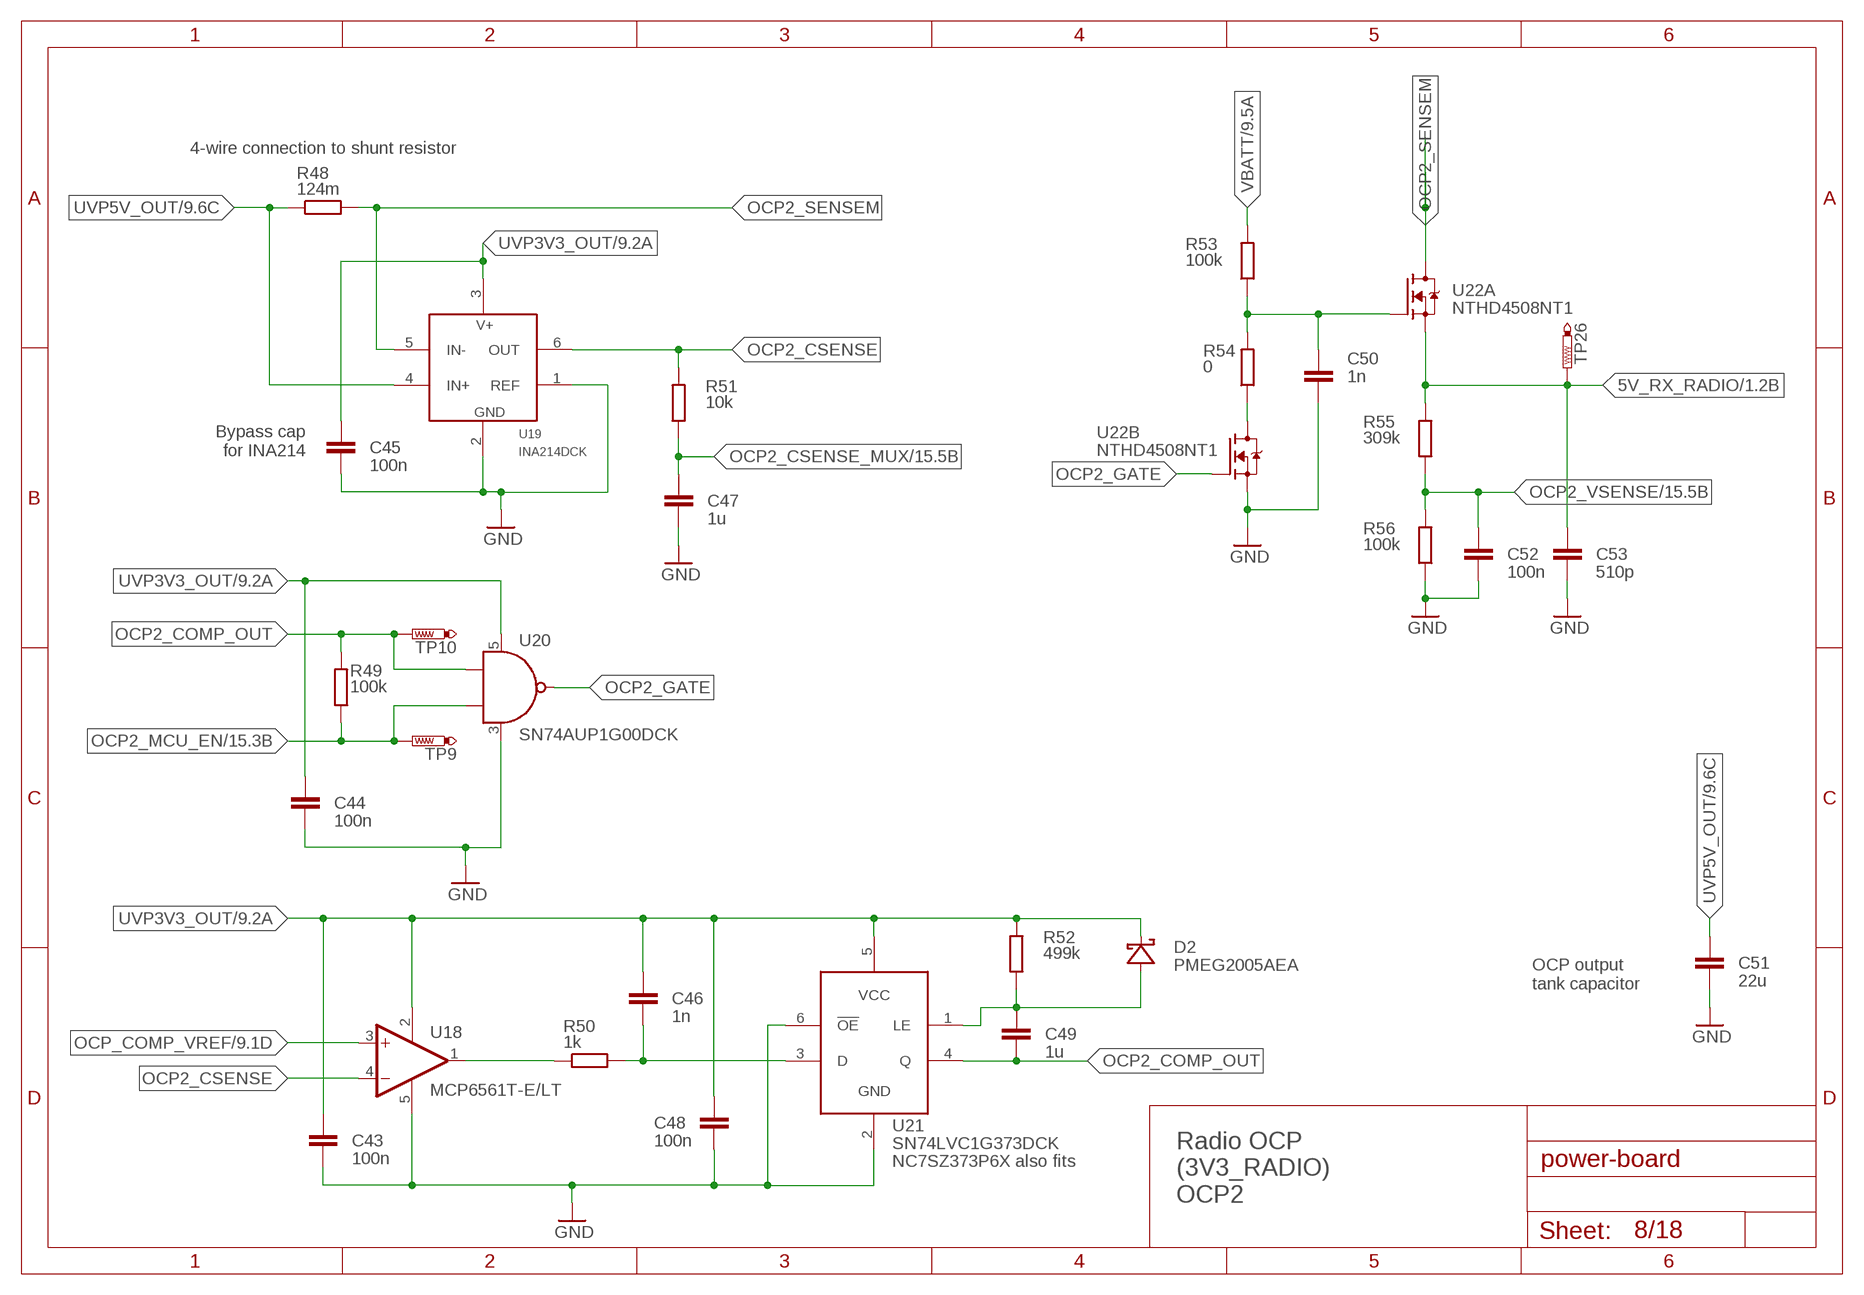
[diagram p7: schematic, sheet 8]

### Parts
C43  100n  C-EUC0603  [C0603]
C44  100n  C-EUC0603  [C0603]
C45  100n  C-EUC0603  [C0603]
C46  1n  C-EUC0603  [C0603]
C47  1u  C-EUC0603  [C0603]
C48  100n  C-EUC0603  [C0603]
C49  1u  C-EUC0603  [C0603]
C50  1n  C-EUC0603  [C0603]
C51  22u  C-EUC1210  [C1210]
C52  100n  C-EUC0603  [C0603]
C53  510p  C-EUC0603  [C0603]
D2  PMEG2005AEA  [SOD-323]
R48  124m  R-EU_R1206  [R1206]
R49  100k  R-EU_R0603  [R0603]
R50  1k  R-EU_R0603  [R0603]
R51  10k  R-EU_R0603  [R0603]
R52  499k  R-EU_R0603  [R0603]
R53  100k  R-EU_R0603  [R0603]
R54  0  R-EU_R0603  [R0603]
R55  309k  R-EU_R0603  [R0603]
R56  100k  R-EU_R0603  [R0603]
TP9  PTR1TP09R  [TP09R]
TP10  PTR1TP09R  [TP09R]
TP26  PTR1TP09R  [TP09R]
U18  MCP6561T-E/LT  [SOT23-5]
U19  INA214DCK  [SC70-6]
U20  SN74AUP1G00DCK  [SC70-5]
U21  SN74LVC1G373DCK  [SC70-6]
U22  NTHD4508NT1  [CHIPFET-1206A-S2]

### Nets
5V_RX_RADIO: C53.1 R55.2 TP26.TP U22.1(A:S) ; also sheet 1
GND: C43.2 C44.2 C45.2 C47.2 C48.2 C50.2 C51.2 C52.2 C53.2 R56.1 U18.5(V-) U19.1(REF) U19.2(GND) U20.3(V-) U21.2(GND) U21.6(!OE) U22.3(B:S) ; also sheet 1,2,3,4,5,6,7,9,10,11,12,13,14,15,16,18
N$1: R54.1 U22.5(B:D) U22.6(B:D)
N$16: C46.1 R50.2 U21.3(D)
N$17: R50.1 U18.1(OUT)
N$18: C49.1 D2.2(A) R52.1 U21.1(LE)
N$20: C50.1 R53.1 R54.2 U22.2(A:G)
OCP2_COMP_OUT: C49.2 R49.2 TP10.TP U20.1(A) U21.4(Q)
OCP2_CSENSE: R51.2 U18.4(-IN) U19.6(OUT)
OCP2_CSENSE_MUX: C47.1 R51.1 ; also sheet 15
OCP2_GATE: U20.4(Y) U22.4(B:G)
OCP2_MCU_EN: R49.1 TP9.TP U20.2(B) ; also sheet 15
OCP2_SENSEM: R48.2 U19.5(IN-) U22.7(A:D) U22.8(A:D)
OCP2_VSENSE: C52.1 R55.1 R56.2 ; also sheet 15
OCP_COMP_VREF: U18.3(+IN) ; also sheet 6,7,9,10,11,12
UVP3V3_OUT: C43.1 C44.1 C45.1 C46.2 C48.1 D2.1(C) R52.2 U18.2(V+) U19.3(V+) U20.5(V+) U21.5(VCC) ; also sheet 1,2,3,4,5,6,7,9,10,11,12,13,15
UVP5V_OUT: C51.1 R48.1 U19.4(IN+) ; also sheet 5,7,9,14
VBATT: R53.2 ; also sheet 1,5,7,9,10,11,12,13,14,17

### Notes on the sheet
- 4-wire connection to shunt resistor
- Bypass cap
  for INA214
- OCP output
  tank capacitor
- Radio OCP
  (3V3_RADIO)
  OCP2
- NC7SZ373P6X also fits

## Sheet 9 of 18: OCP3 5V Camera
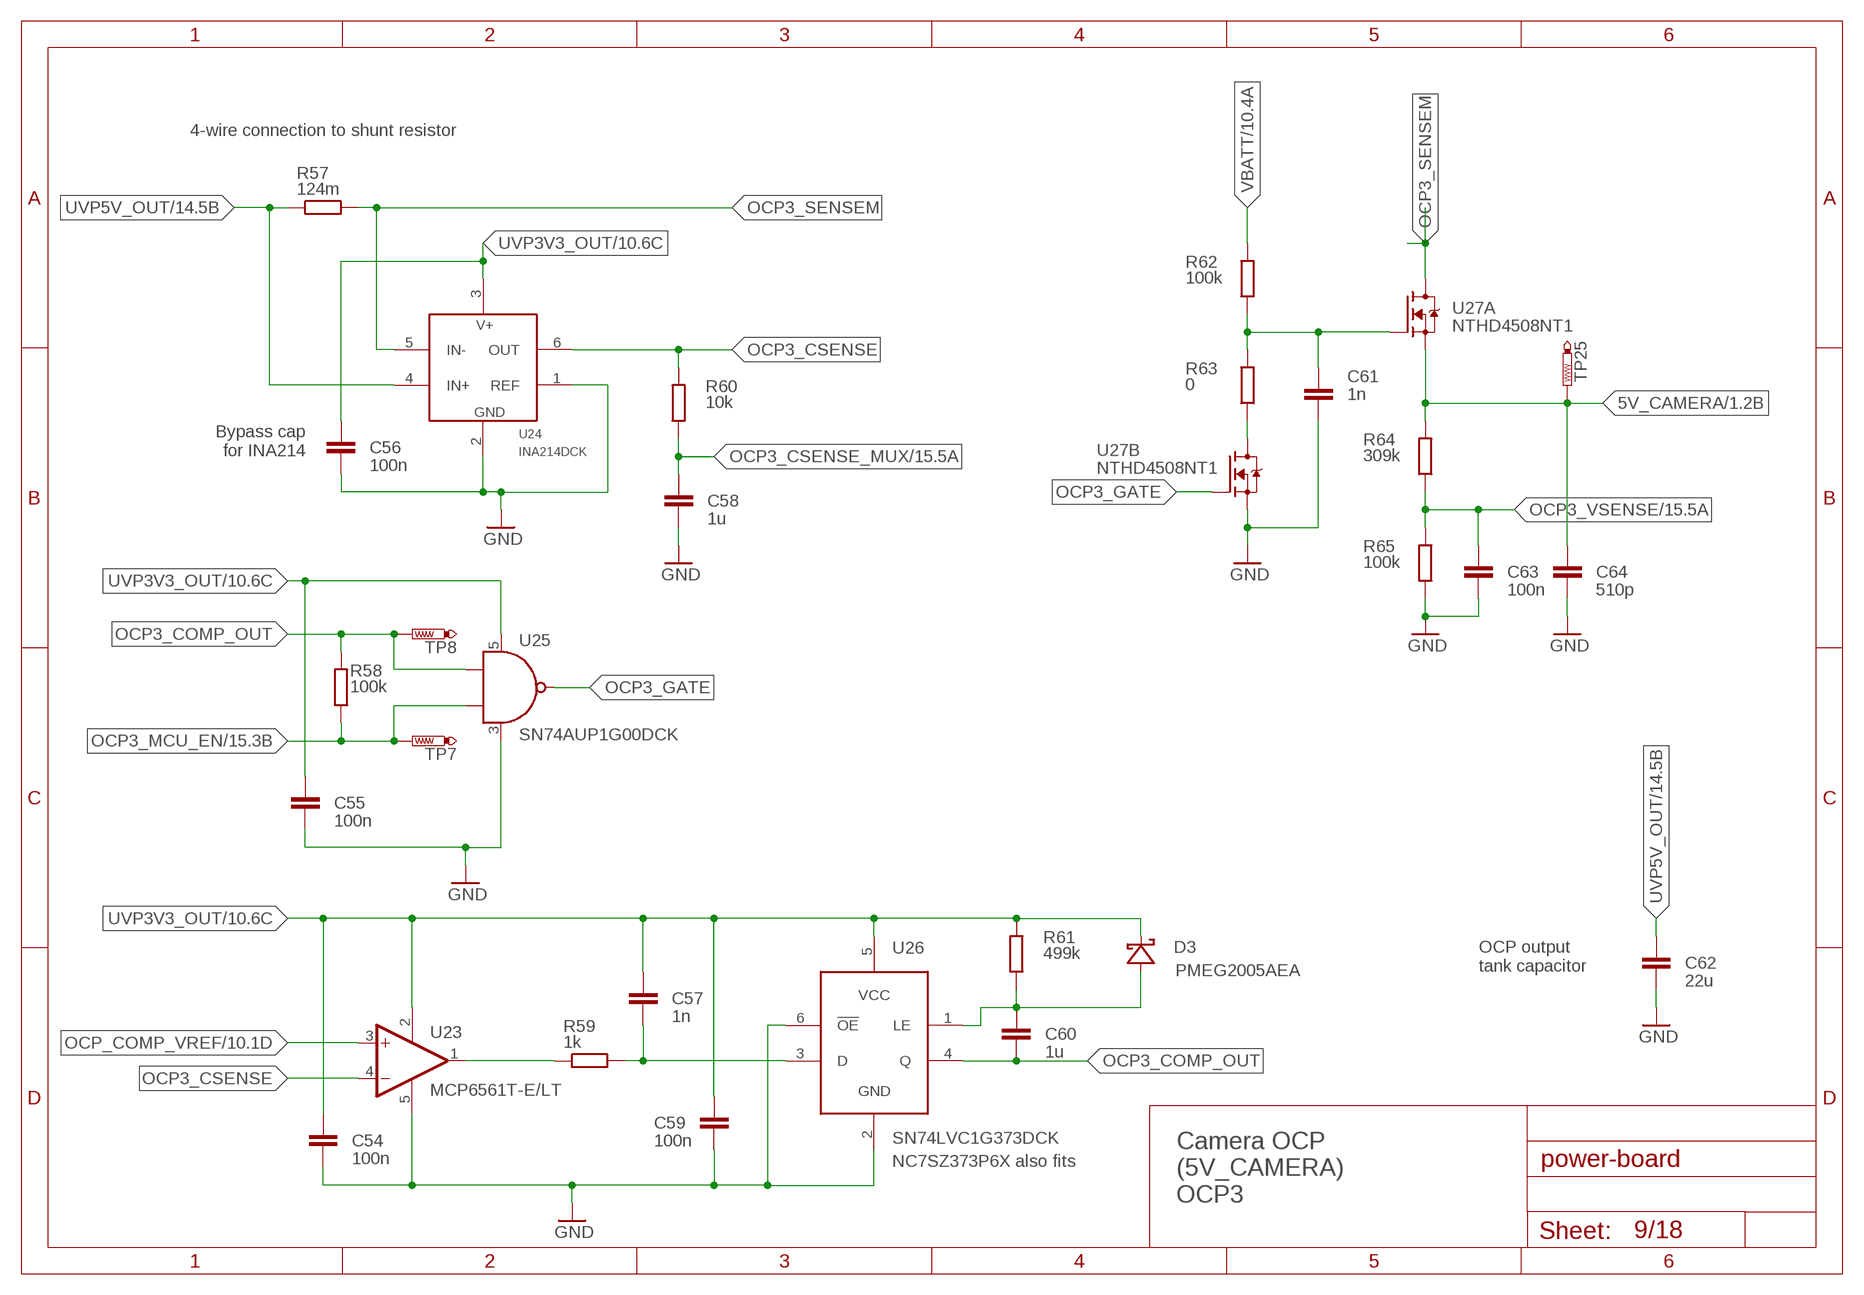
[diagram p8: schematic, sheet 9]

### Parts
C54  100n  C-EUC0603  [C0603]
C55  100n  C-EUC0603  [C0603]
C56  100n  C-EUC0603  [C0603]
C57  1n  C-EUC0603  [C0603]
C58  1u  C-EUC0603  [C0603]
C59  100n  C-EUC0603  [C0603]
C60  1u  C-EUC0603  [C0603]
C61  1n  C-EUC0603  [C0603]
C62  22u  C-EUC1210  [C1210]
C63  100n  C-EUC0603  [C0603]
C64  510p  C-EUC0603  [C0603]
D3  PMEG2005AEA  [SOD-323]
R57  124m  R-EU_R1206  [R1206]
R58  100k  R-EU_R0603  [R0603]
R59  1k  R-EU_R0603  [R0603]
R60  10k  R-EU_R0603  [R0603]
R61  499k  R-EU_R0603  [R0603]
R62  100k  R-EU_R0603  [R0603]
R63  0  R-EU_R0603  [R0603]
R64  309k  R-EU_R0603  [R0603]
R65  100k  R-EU_R0603  [R0603]
TP7  PTR1TP09R  [TP09R]
TP8  PTR1TP09R  [TP09R]
TP25  PTR1TP09R  [TP09R]
U23  MCP6561T-E/LT  [SOT23-5]
U24  INA214DCK  [SC70-6]
U25  SN74AUP1G00DCK  [SC70-5]
U26  SN74LVC1G373DCK  [SC70-6]
U27  NTHD4508NT1  [CHIPFET-1206A-S2]

### Nets
5V_CAMERA: C64.1 R64.2 TP25.TP U27.1(A:S) ; also sheet 1
GND: C54.2 C55.2 C56.2 C58.2 C59.2 C61.2 C62.2 C63.2 C64.2 R65.1 U23.5(V-) U24.1(REF) U24.2(GND) U25.3(V-) U26.2(GND) U26.6(!OE) U27.3(B:S) ; also sheet 1,2,3,4,5,6,7,8,10,11,12,13,14,15,16,18
N$19: R63.1 U27.5(B:D) U27.6(B:D)
N$27: C57.1 R59.2 U26.3(D)
N$28: R59.1 U23.1(OUT)
N$29: C60.1 D3.2(A) R61.1 U26.1(LE)
N$31: C61.1 R62.1 R63.2 U27.2(A:G)
OCP3_COMP_OUT: C60.2 R58.2 TP8.TP U25.1(A) U26.4(Q)
OCP3_CSENSE: R60.2 U23.4(-IN) U24.6(OUT)
OCP3_CSENSE_MUX: C58.1 R60.1 ; also sheet 15
OCP3_GATE: U25.4(Y) U27.4(B:G)
OCP3_MCU_EN: R58.1 TP7.TP U25.2(B) ; also sheet 15
OCP3_SENSEM: R57.2 U24.5(IN-) U27.7(A:D) U27.8(A:D)
OCP3_VSENSE: C63.1 R64.1 R65.2 ; also sheet 15
OCP_COMP_VREF: U23.3(+IN) ; also sheet 6,7,8,10,11,12
UVP3V3_OUT: C54.1 C55.1 C56.1 C57.2 C59.1 D3.1(C) R61.2 U23.2(V+) U24.3(V+) U25.5(V+) U26.5(VCC) ; also sheet 1,2,3,4,5,6,7,8,10,11,12,13,15
UVP5V_OUT: C62.1 R57.1 U24.4(IN+) ; also sheet 5,7,8,14
VBATT: R62.2 ; also sheet 1,5,7,8,10,11,12,13,14,17

### Notes on the sheet
- 4-wire connection to shunt resistor
- Bypass cap
  for INA214
- OCP output
  tank capacitor
- Camera OCP
  (5V_CAMERA)
  OCP3
- NC7SZ373P6X also fits

## Sheet 10 of 18: OCP4 3V3_FLIGHT_MCU
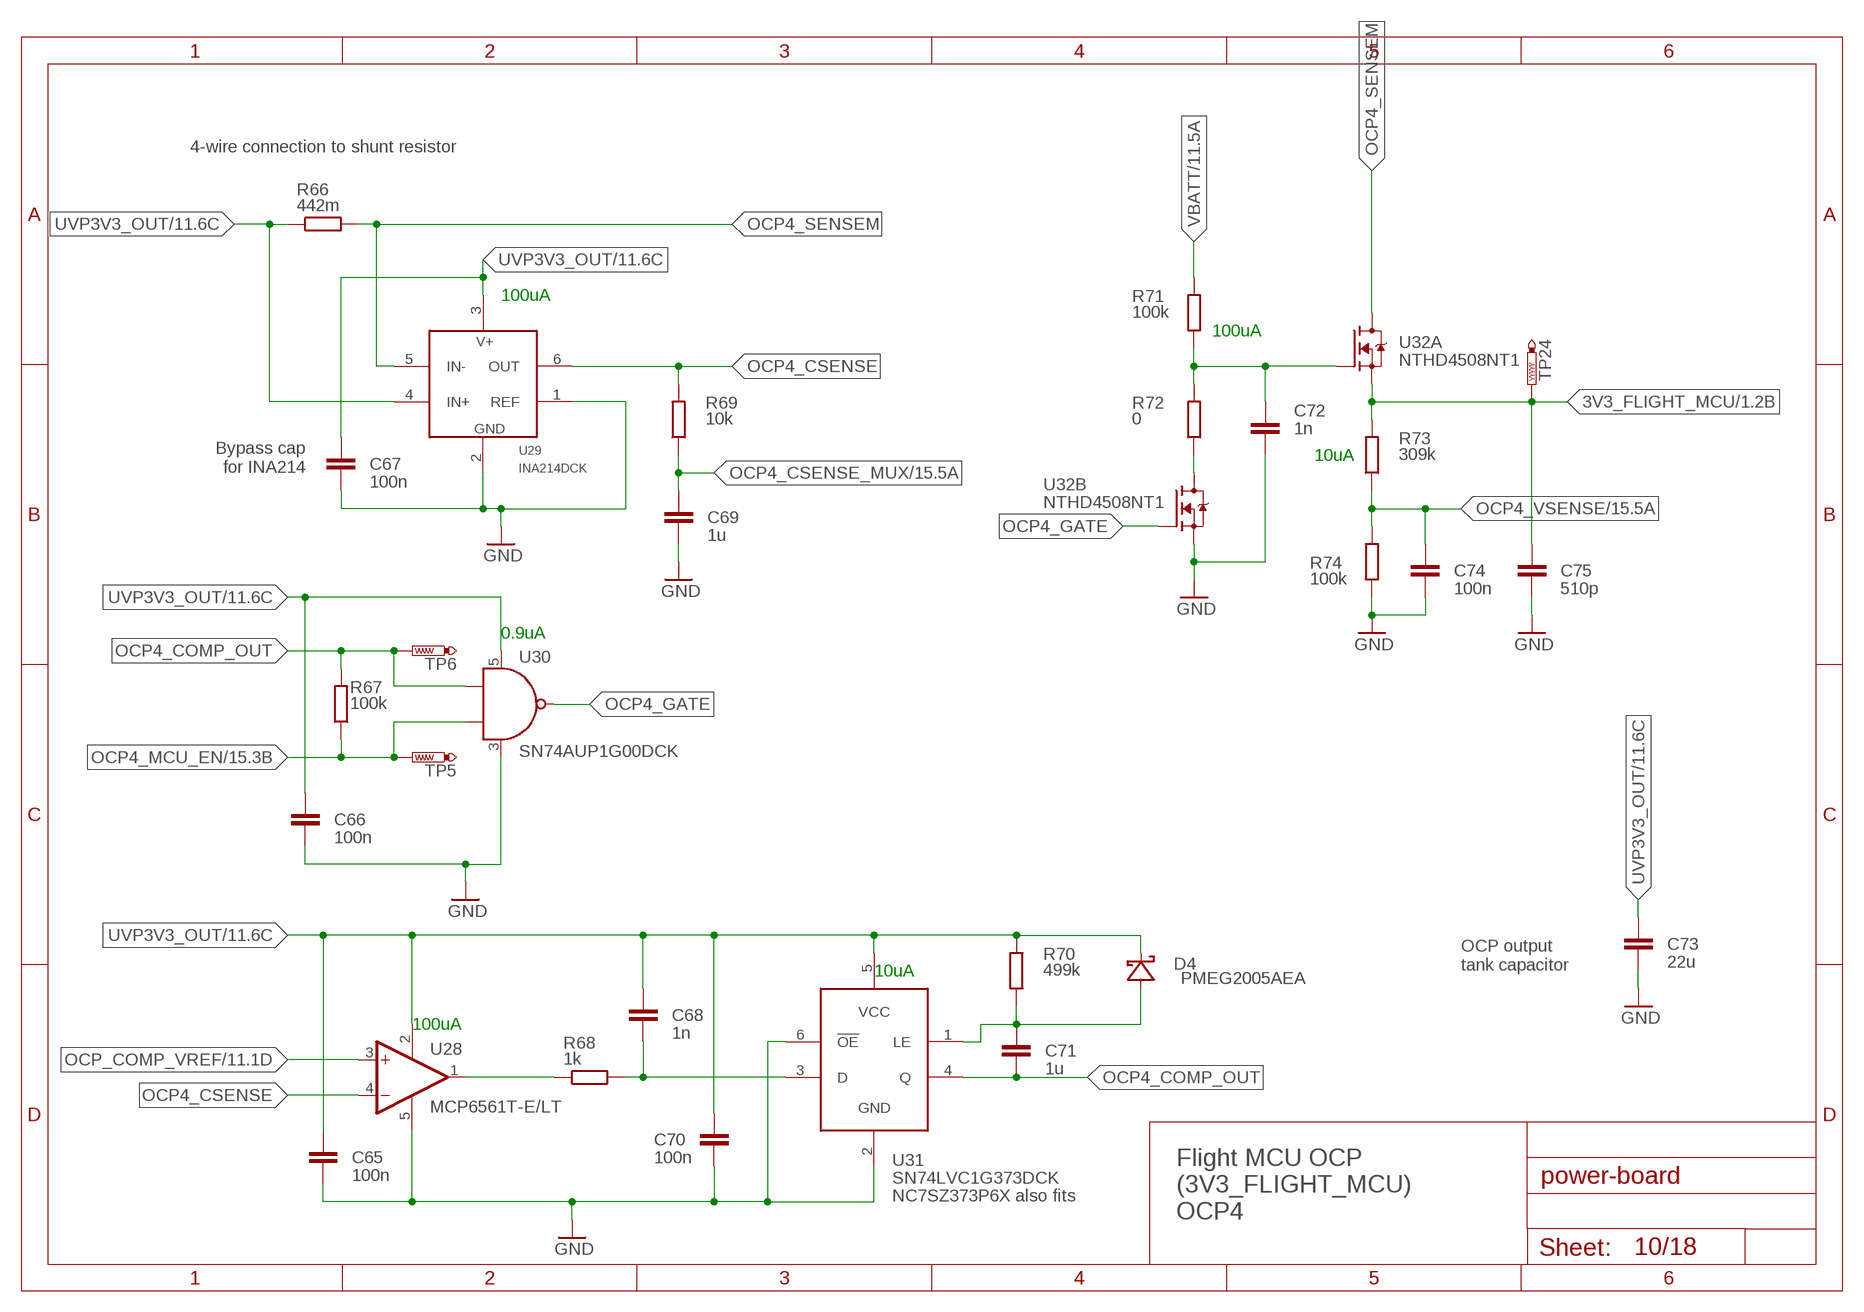
[diagram p9: schematic, sheet 10]

### Parts
C65  100n  C-EUC0603  [C0603]
C66  100n  C-EUC0603  [C0603]
C67  100n  C-EUC0603  [C0603]
C68  1n  C-EUC0603  [C0603]
C69  1u  C-EUC0603  [C0603]
C70  100n  C-EUC0603  [C0603]
C71  1u  C-EUC0603  [C0603]
C72  1n  C-EUC0603  [C0603]
C73  22u  C-EUC1210  [C1210]
C74  100n  C-EUC0603  [C0603]
C75  510p  C-EUC0603  [C0603]
D4  PMEG2005AEA  [SOD-323]
R66  442m  R-EU_R1206  [R1206]
R67  100k  R-EU_R0603  [R0603]
R68  1k  R-EU_R0603  [R0603]
R69  10k  R-EU_R0603  [R0603]
R70  499k  R-EU_R0603  [R0603]
R71  100k  R-EU_R0603  [R0603]
R72  0  R-EU_R0603  [R0603]
R73  309k  R-EU_R0603  [R0603]
R74  100k  R-EU_R0603  [R0603]
TP5  PTR1TP09R  [TP09R]
TP6  PTR1TP09R  [TP09R]
TP24  PTR1TP09R  [TP09R]
U28  MCP6561T-E/LT  [SOT23-5]
U29  INA214DCK  [SC70-6]
U30  SN74AUP1G00DCK  [SC70-5]
U31  SN74LVC1G373DCK  [SC70-6]
U32  NTHD4508NT1  [CHIPFET-1206A-S2]

### Nets
3V3_FLIGHT_MCU: C75.1 R73.2 TP24.TP U32.1(A:S) ; also sheet 1
GND: C65.2 C66.2 C67.2 C69.2 C70.2 C72.2 C73.2 C74.2 C75.2 R74.1 U28.5(V-) U29.1(REF) U29.2(GND) U30.3(V-) U31.2(GND) U31.6(!OE) U32.3(B:S) ; also sheet 1,2,3,4,5,6,7,8,9,11,12,13,14,15,16,18
N$30: R72.1 U32.5(B:D) U32.6(B:D)
N$50: C68.1 R68.2 U31.3(D)
N$51: R68.1 U28.1(OUT)
N$52: C71.1 D4.2(A) R70.1 U31.1(LE)
N$54: C72.1 R71.1 R72.2 U32.2(A:G)
OCP4_COMP_OUT: C71.2 R67.2 TP6.TP U30.1(A) U31.4(Q)
OCP4_CSENSE: R69.2 U28.4(-IN) U29.6(OUT)
OCP4_CSENSE_MUX: C69.1 R69.1 ; also sheet 15
OCP4_GATE: U30.4(Y) U32.4(B:G)
OCP4_MCU_EN: R67.1 TP5.TP U30.2(B) ; also sheet 15
OCP4_SENSEM: R66.2 U29.5(IN-) U32.7(A:D) U32.8(A:D)
OCP4_VSENSE: C74.1 R73.1 R74.2 ; also sheet 15
OCP_COMP_VREF: U28.3(+IN) ; also sheet 6,7,8,9,11,12
UVP3V3_OUT: C65.1 C66.1 C67.1 C68.2 C70.1 C73.1 D4.1(C) R66.1 R70.2 U28.2(V+) U29.3(V+) U29.4(IN+) U30.5(V+) U31.5(VCC) ; also sheet 1,2,3,4,5,6,7,8,9,11,12,13,15
VBATT: R71.2 ; also sheet 1,5,7,8,9,11,12,13,14,17

### Notes on the sheet
- 4-wire connection to shunt resistor
- 100uA
- 100uA
- 10uA
- Bypass cap
  for INA214
- 0.9uA
- 10uA
- OCP output
  tank capacitor
- 100uA
- Flight MCU OCP
  (3V3_FLIGHT_MCU)
  OCP4
- NC7SZ373P6X also fits

## Sheet 11 of 18: OCP5 OEM615_3V3
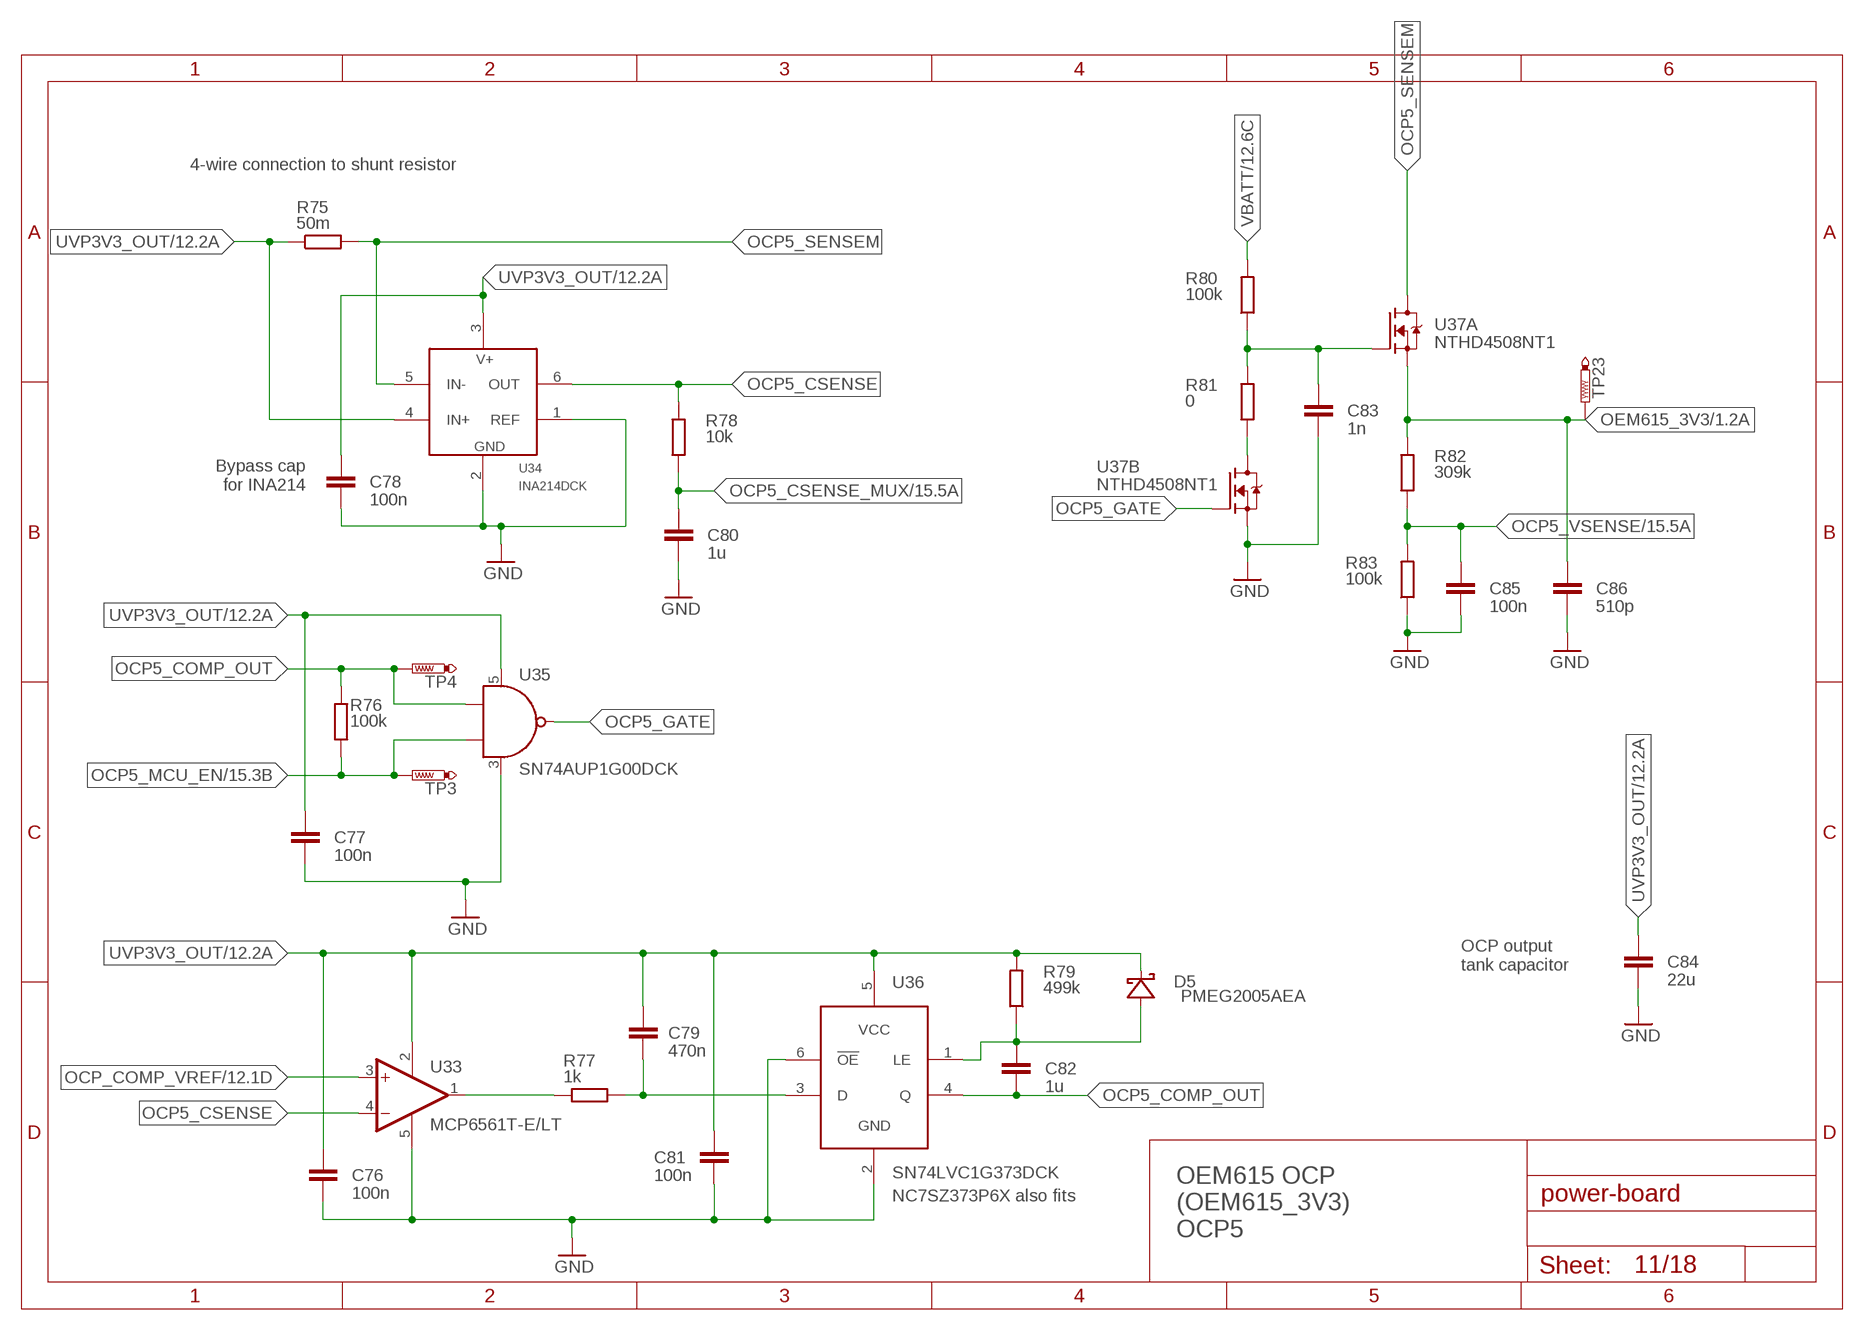
[diagram p10: schematic, sheet 11]

### Parts
C76  100n  C-EUC0603  [C0603]
C77  100n  C-EUC0603  [C0603]
C78  100n  C-EUC0603  [C0603]
C79  470n  C-EUC0603  [C0603]
C80  1u  C-EUC0603  [C0603]
C81  100n  C-EUC0603  [C0603]
C82  1u  C-EUC0603  [C0603]
C83  1n  C-EUC0603  [C0603]
C84  22u  C-EUC1210  [C1210]
C85  100n  C-EUC0603  [C0603]
C86  510p  C-EUC0603  [C0603]
D5  PMEG2005AEA  [SOD-323]
R75  50m  R-EU_R1206  [R1206]
R76  100k  R-EU_R0603  [R0603]
R77  1k  R-EU_R0603  [R0603]
R78  10k  R-EU_R0603  [R0603]
R79  499k  R-EU_R0603  [R0603]
R80  100k  R-EU_R0603  [R0603]
R81  0  R-EU_R0603  [R0603]
R82  309k  R-EU_R0603  [R0603]
R83  100k  R-EU_R0603  [R0603]
TP3  PTR1TP09R  [TP09R]
TP4  PTR1TP09R  [TP09R]
TP23  PTR1TP09R  [TP09R]
U33  MCP6561T-E/LT  [SOT23-5]
U34  INA214DCK  [SC70-6]
U35  SN74AUP1G00DCK  [SC70-5]
U36  SN74LVC1G373DCK  [SC70-6]
U37  NTHD4508NT1  [CHIPFET-1206A-S2]

### Nets
GND: C76.2 C77.2 C78.2 C80.2 C81.2 C83.2 C84.2 C85.2 C86.2 R83.1 U33.5(V-) U34.1(REF) U34.2(GND) U35.3(V-) U36.2(GND) U36.6(!OE) U37.3(B:S) ; also sheet 1,2,3,4,5,6,7,8,9,10,12,13,14,15,16,18
N$43: R81.1 U37.5(B:D) U37.6(B:D)
N$65: C79.1 R77.2 U36.3(D)
N$66: R77.1 U33.1(OUT)
N$67: C82.1 D5.2(A) R79.1 U36.1(LE)
N$69: C83.1 R80.1 R81.2 U37.2(A:G)
OCP5_COMP_OUT: C82.2 R76.2 TP4.TP U35.1(A) U36.4(Q)
OCP5_CSENSE: R78.2 U33.4(-IN) U34.6(OUT)
OCP5_CSENSE_MUX: C80.1 R78.1 ; also sheet 15
OCP5_GATE: U35.4(Y) U37.4(B:G)
OCP5_MCU_EN: R76.1 TP3.TP U35.2(B) ; also sheet 15
OCP5_SENSEM: R75.2 U34.5(IN-) U37.7(A:D) U37.8(A:D)
OCP5_VSENSE: C85.1 R82.1 R83.2 ; also sheet 15
OCP_COMP_VREF: U33.3(+IN) ; also sheet 6,7,8,9,10,12
OEM615_3V3: C86.1 R82.2 TP23.TP U37.1(A:S) ; also sheet 1
UVP3V3_OUT: C76.1 C77.1 C78.1 C79.2 C81.1 C84.1 D5.1(C) R75.1 R79.2 U33.2(V+) U34.3(V+) U34.4(IN+) U35.5(V+) U36.5(VCC) ; also sheet 1,2,3,4,5,6,7,8,9,10,12,13,15
VBATT: R80.2 ; also sheet 1,5,7,8,9,10,12,13,14,17

### Notes on the sheet
- 4-wire connection to shunt resistor
- Bypass cap
  for INA214
- OCP output
  tank capacitor
- OEM615 OCP
  (OEM615_3V3)
  OCP5
- NC7SZ373P6X also fits

## Sheet 12 of 18: OCP6 GPS LNA (OEM615_LNA_PWR) Powered from VBATT (after deployment FET)
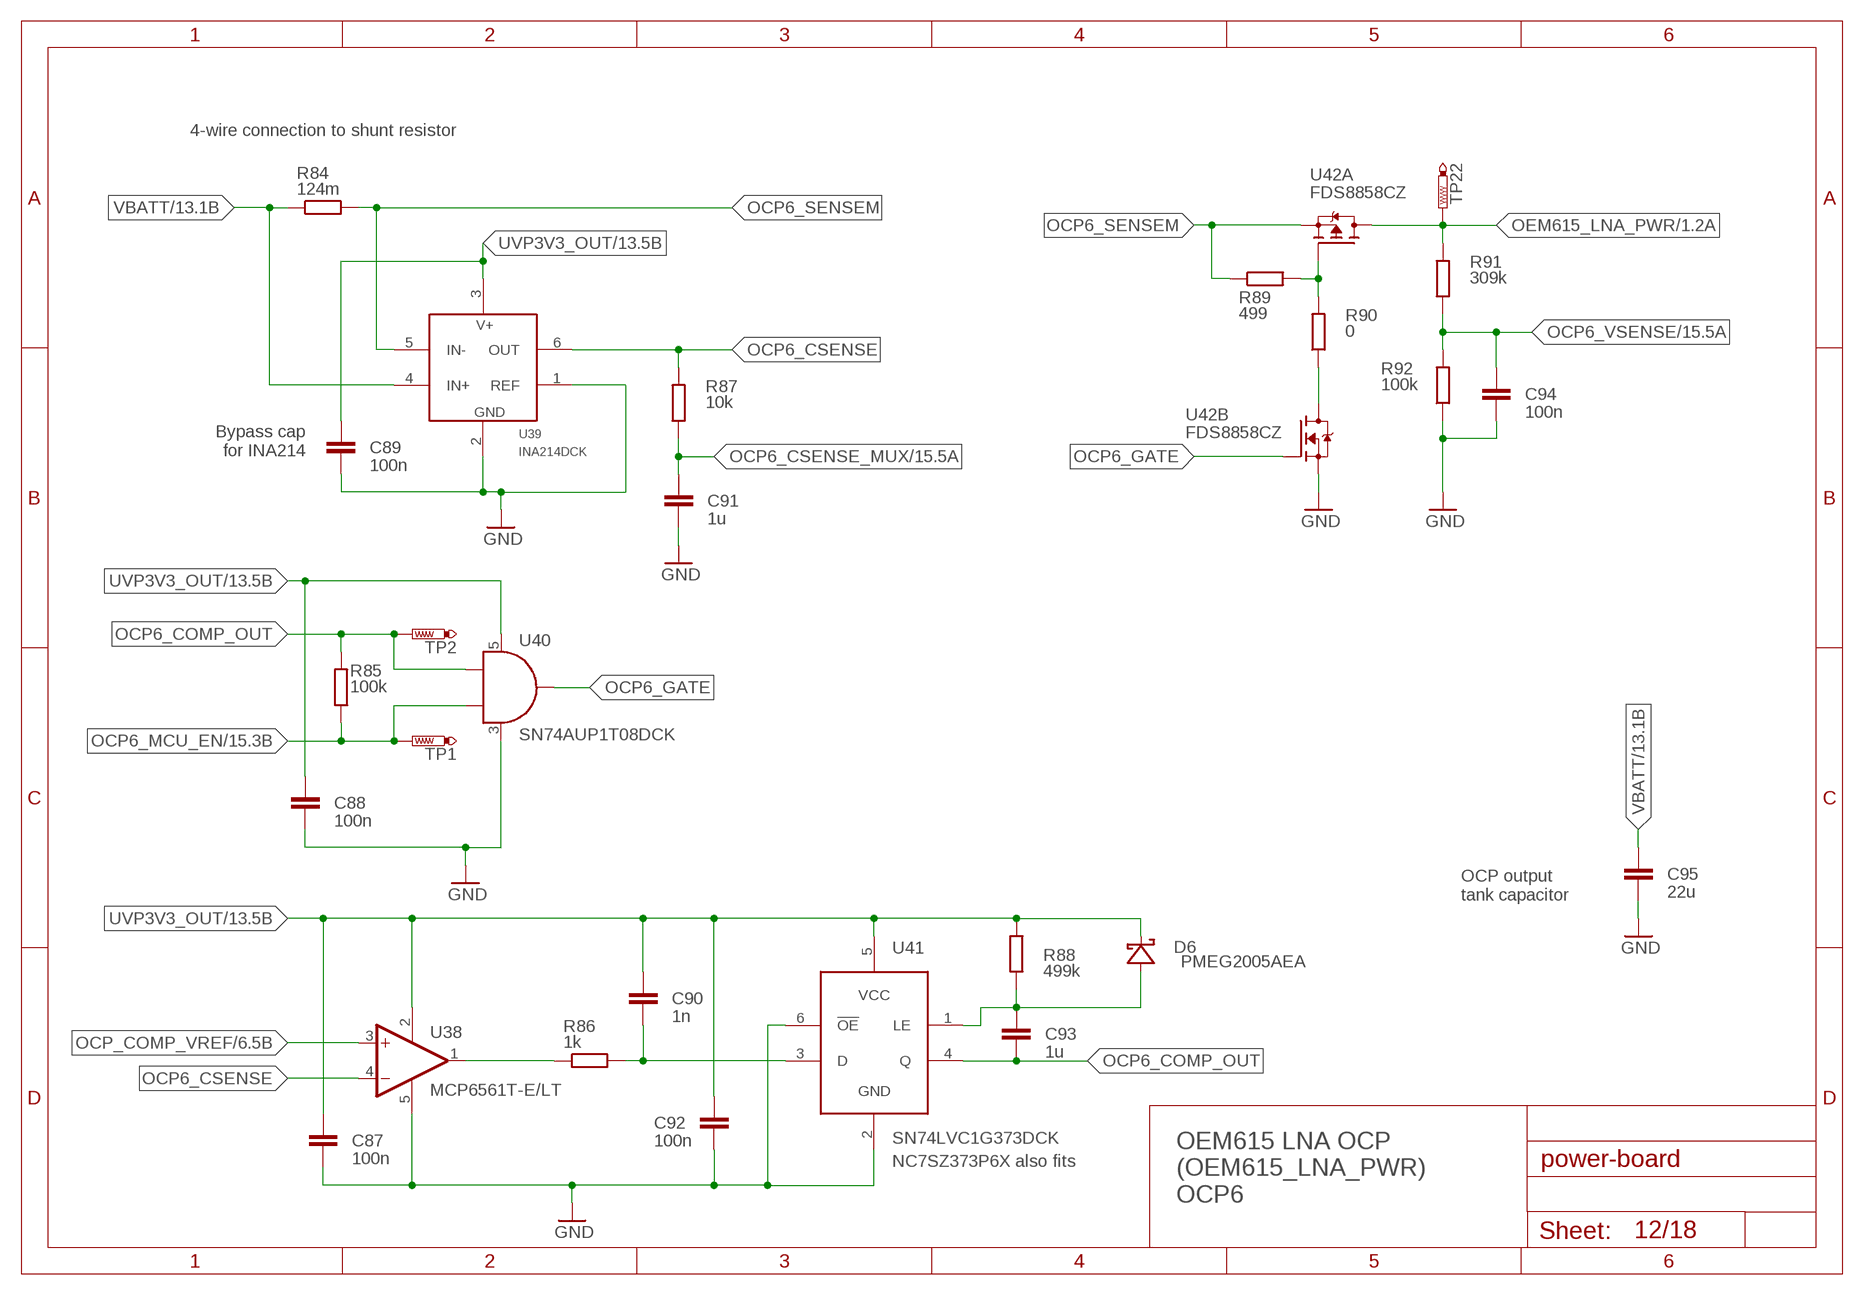
[diagram p11: schematic, sheet 12]

### Parts
C87  100n  C-EUC0603  [C0603]
C88  100n  C-EUC0603  [C0603]
C89  100n  C-EUC0603  [C0603]
C90  1n  C-EUC0603  [C0603]
C91  1u  C-EUC0603  [C0603]
C92  100n  C-EUC0603  [C0603]
C93  1u  C-EUC0603  [C0603]
C94  100n  C-EUC0603  [C0603]
C95  22u  C-EUC1210  [C1210]
D6  PMEG2005AEA  [SOD-323]
R84  124m  R-EU_R1206  [R1206]
R85  100k  R-EU_R0603  [R0603]
R86  1k  R-EU_R0603  [R0603]
R87  10k  R-EU_R0603  [R0603]
R88  499k  R-EU_R0603  [R0603]
R89  499  R-EU_R0603  [R0603]
R90  0  R-EU_R0603  [R0603]
R91  309k  R-EU_R0603  [R0603]
R92  100k  R-EU_R0603  [R0603]
TP1  PTR1TP09R  [TP09R]
TP2  PTR1TP09R  [TP09R]
TP22  PTR1TP09R  [TP09R]
U38  MCP6561T-E/LT  [SOT23-5]
U39  INA214DCK  [SC70-6]
U40  SN74AUP1T08DCK  [SC70-5]
U41  SN74LVC1G373DCK  [SC70-6]
U42  FDS8858CZ  [SO8]

### Nets
GND: C87.2 C88.2 C89.2 C91.2 C92.2 C94.2 C95.2 R92.1 U38.5(V-) U39.1(REF) U39.2(GND) U40.3(V-) U41.2(GND) U41.6(!OE) U42.1(B:S) ; also sheet 1,2,3,4,5,6,7,8,9,10,11,13,14,15,16,18
N$78: C90.1 R86.2 U41.3(D)
N$79: R86.1 U38.1(OUT)
N$80: C93.1 D6.2(A) R88.1 U41.1(LE)
N$203: R89.2 R90.2 U42.4(A:G)
N$204: R90.1 U42.7(B:D) U42.8(B:D)
OCP6_COMP_OUT: C93.2 R85.2 TP2.TP U40.1(A) U41.4(Q)
OCP6_CSENSE: R87.2 U38.4(-IN) U39.6(OUT)
OCP6_CSENSE_MUX: C91.1 R87.1 ; also sheet 15
OCP6_GATE: U40.4(Y) U42.2(B:G)
OCP6_MCU_EN: R85.1 TP1.TP U40.2(B) ; also sheet 15
OCP6_SENSEM: R84.2 R89.1 U39.5(IN-) U42.3(A:S)
OCP6_VSENSE: C94.1 R91.1 R92.2 ; also sheet 15
OCP_COMP_VREF: U38.3(+IN) ; also sheet 6,7,8,9,10,11
OEM615_LNA_PWR: R91.2 TP22.TP U42.5(A:D) U42.6(A:D) ; also sheet 1
UVP3V3_OUT: C87.1 C88.1 C89.1 C90.2 C92.1 D6.1(C) R88.2 U38.2(V+) U39.3(V+) U40.5(V+) U41.5(VCC) ; also sheet 1,2,3,4,5,6,7,8,9,10,11,13,15
VBATT: C95.1 R84.1 U39.4(IN+) ; also sheet 1,5,7,8,9,10,11,13,14,17

### Notes on the sheet
- 4-wire connection to shunt resistor
- Bypass cap
  for INA214
- OCP output
  tank capacitor
- OEM615 LNA OCP
  (OEM615_LNA_PWR)
  OCP6
- NC7SZ373P6X also fits

## Sheet 13 of 18: 3V3 Regulator and UVP
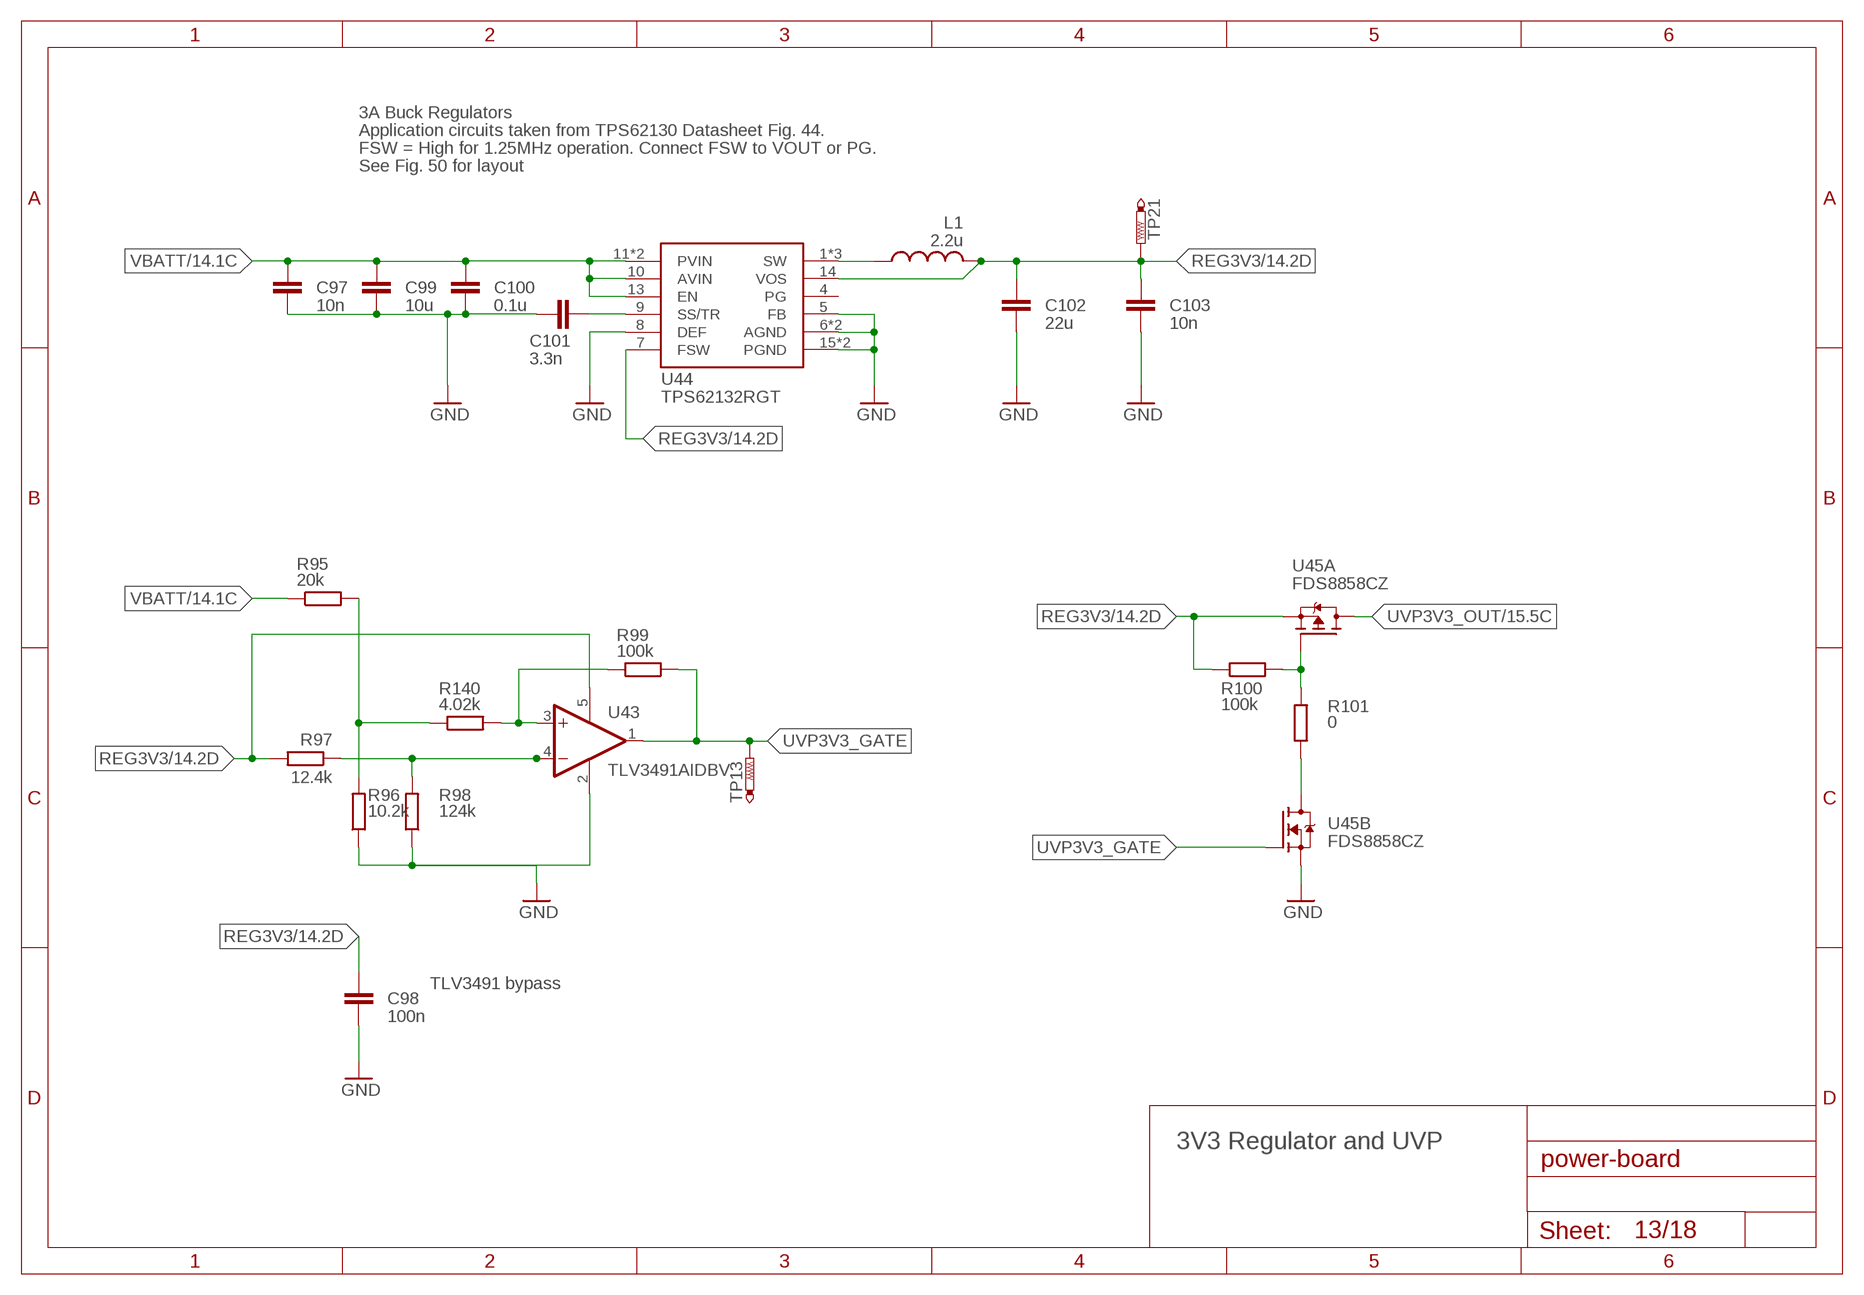
[diagram p12: schematic, sheet 13]

### Parts
C97  10n  C-EUC0603  [C0603]
C98  100n  C-EUC0603  [C0603]
C99  10u  C-EUC1206  [C1206]
C100  0.1u  C-EUC0603  [C0603]
C101  3.3n  C-EUC0603  [C0603]
C102  22u  C-EUC1210  [C1210]
C103  10n  C-EUC0603  [C0603]
L1  2.2u  VISHAY-INDUCTOR  [VISHAY-INDUCTOR]
R95  20k  R-EU_R0603  [R0603]
R96  10.2k  R-EU_R0603  [R0603]
R97  12.4k  R-EU_R0603  [R0603]
R98  124k  R-EU_R0603  [R0603]
R99  100k  R-EU_R0603  [R0603]
R100  100k  R-EU_R0603  [R0603]
R101  0  R-EU_R0603  [R0603]
R140  4.02k  R-EU_R0603  [R0603]
TP13  PTR1TP09R  [TP09R]
TP21  PTR1TP09R  [TP09R]
U43  TLV3491AIDBV  [SOT23-5]
U44  TPS62132RGT  [RGT.16]
U45  FDS8858CZ  [SO8]

### Nets
GND: C97.2 C98.2 C99.2 C100.2 C101.1 C102.2 C103.2 R96.1 R98.1 U43.2(V-) U44.5(FB) U44.6(AGND) U44.8(DEF) U44.15(PGND) U44.16(PGND) U44.PAD(AGND) U45.1(B:S) ; also sheet 1,2,3,4,5,6,7,8,9,10,11,12,14,15,16,18
N$7: C101.2 U44.9(SS/TR)
N$8: L1.1 U44.1(SW) U44.2(SW) U44.3(SW)
N$11: R101.1 U45.7(B:D) U45.8(B:D)
N$48: R95.2 R96.2 R140.1
N$49: R99.1 R140.2 U43.3(+IN)
N$58: R100.2 R101.2 U45.4(A:G)
N$767: R97.1 R98.2 U43.4(-IN)
REG3V3: C98.1 C102.1 C103.1 L1.2 R97.2 R100.1 TP21.TP U43.5(V+) U44.7(FSW) U44.14(VOS) U45.3(A:S) ; also sheet 2,14
UVP3V3_GATE: R99.2 TP13.TP U43.1(OUT) U45.2(B:G)
UVP3V3_OUT: U45.5(A:D) U45.6(A:D) ; also sheet 1,2,3,4,5,6,7,8,9,10,11,12,15
VBATT: C97.1 C99.1 C100.1 R95.1 U44.10(AVIN) U44.11(PVIN) U44.12(PVIN) U44.13(EN) ; also sheet 1,5,7,8,9,10,11,12,14,17
Unconnected: U44.4(PG)

### Notes on the sheet
- 3A Buck Regulators
- Application circuits taken from TPS62130 Datasheet Fig. 44.
- FSW = High for 1.25MHz operation. Connect FSW to VOUT or PG.
- See Fig. 50 for layout
- TLV3491 bypass
- 3V3 Regulator and UVP

## Sheet 14 of 18: 5V Regulator and UVP
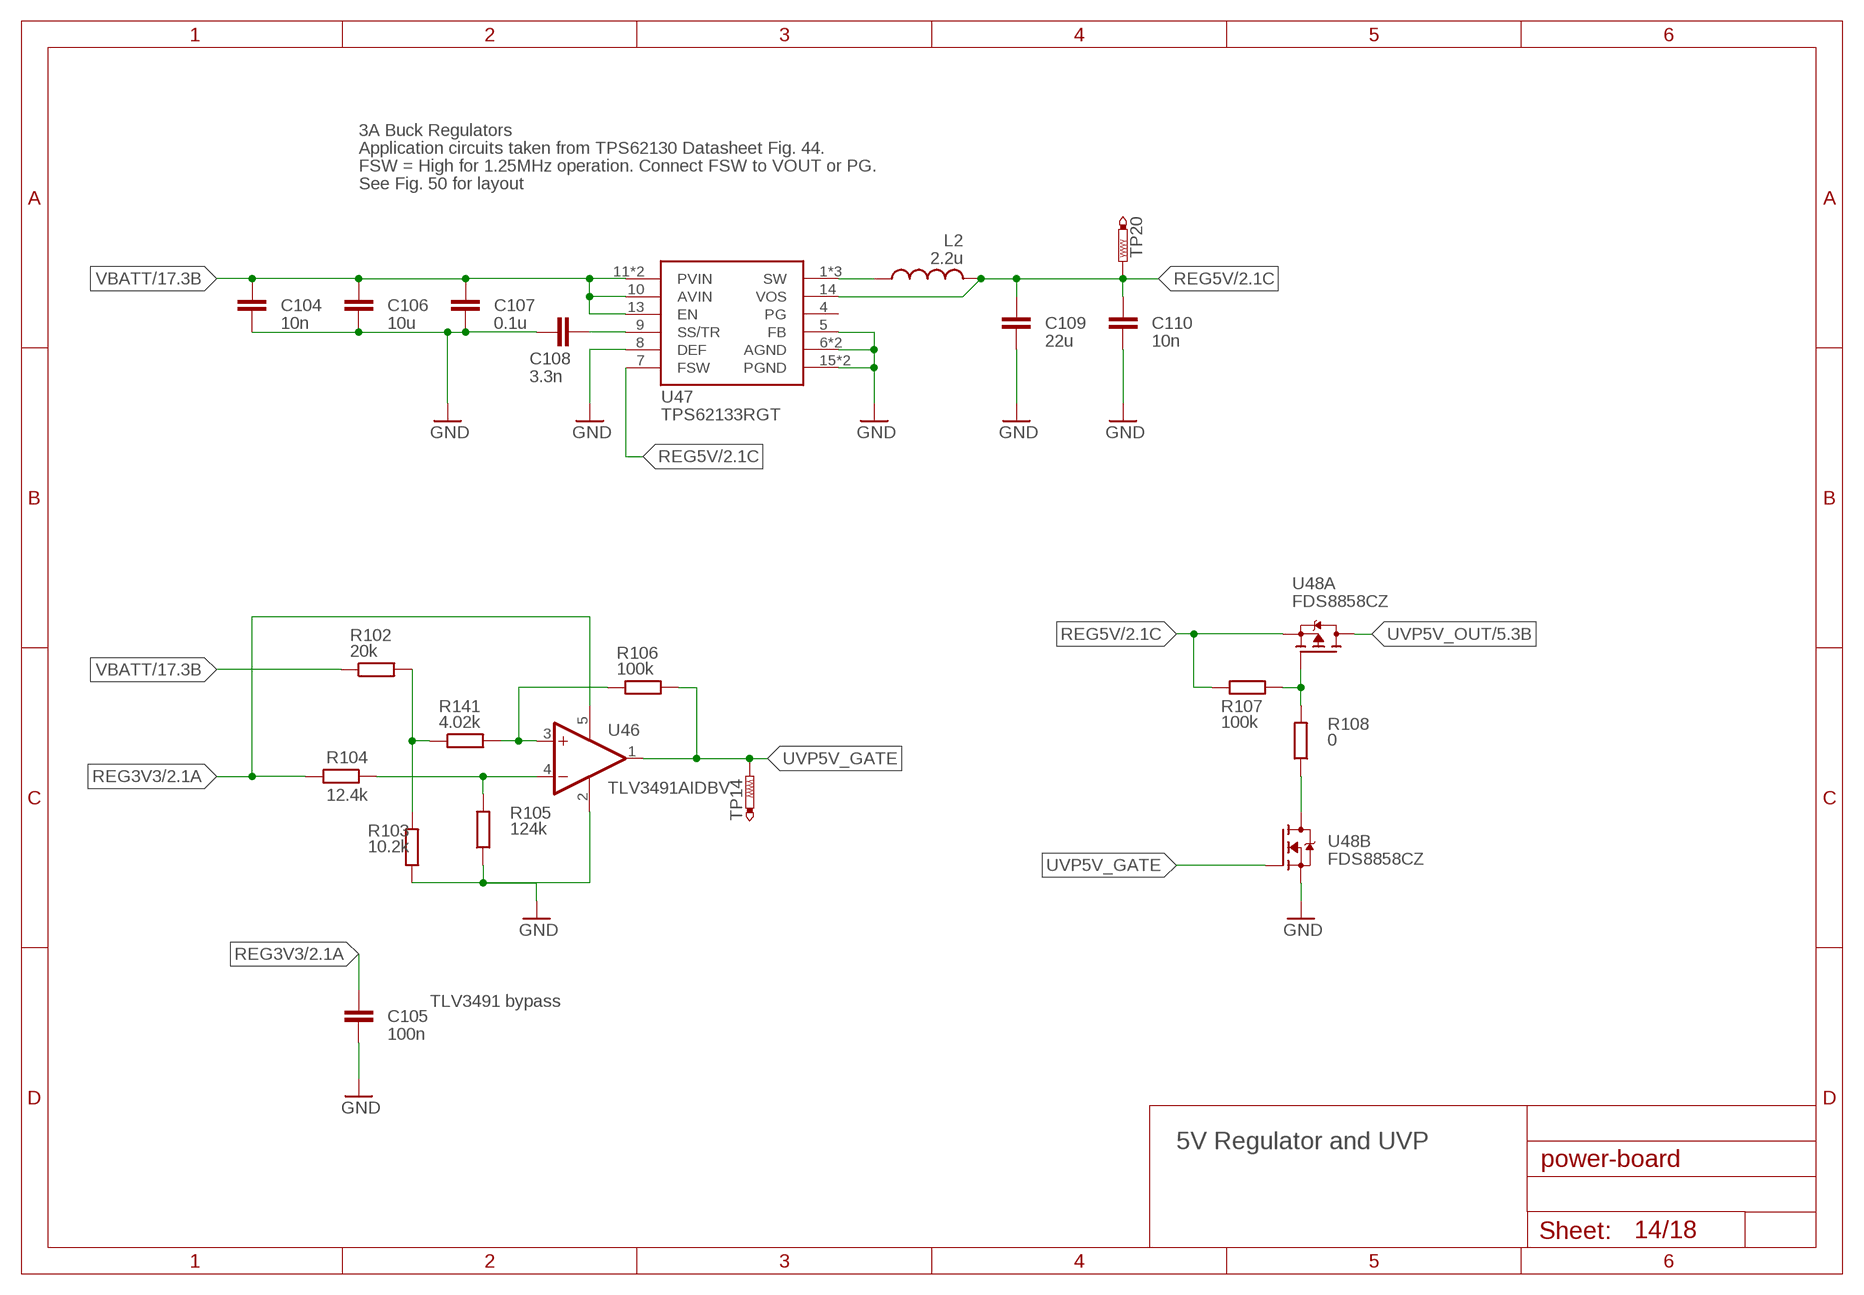
[diagram p13: schematic, sheet 14]

### Parts
C104  10n  C-EUC0603  [C0603]
C105  100n  C-EUC0603  [C0603]
C106  10u  C-EUC1206  [C1206]
C107  0.1u  C-EUC0603  [C0603]
C108  3.3n  C-EUC0603  [C0603]
C109  22u  C-EUC1210  [C1210]
C110  10n  C-EUC0603  [C0603]
L2  2.2u  VISHAY-INDUCTOR  [VISHAY-INDUCTOR]
R102  20k  R-EU_R0603  [R0603]
R103  10.2k  R-EU_R0603  [R0603]
R104  12.4k  R-EU_R0603  [R0603]
R105  124k  R-EU_R0603  [R0603]
R106  100k  R-EU_R0603  [R0603]
R107  100k  R-EU_R0603  [R0603]
R108  0  R-EU_R0603  [R0603]
R141  4.02k  R-EU_R0603  [R0603]
TP14  PTR1TP09R  [TP09R]
TP20  PTR1TP09R  [TP09R]
U46  TLV3491AIDBV  [SOT23-5]
U47  TPS62133RGT  [RGT.16]
U48  FDS8858CZ  [SO8]

### Nets
GND: C104.2 C105.2 C106.2 C107.2 C108.1 C109.2 C110.2 R103.1 R105.1 U46.2(V-) U47.5(FB) U47.6(AGND) U47.8(DEF) U47.15(PGND) U47.16(PGND) U47.PAD(AGND) U48.1(B:S) ; also sheet 1,2,3,4,5,6,7,8,9,10,11,12,13,15,16,18
N$3: C108.2 U47.9(SS/TR)
N$4: L2.1 U47.1(SW) U47.2(SW) U47.3(SW)
N$5: R107.2 R108.2 U48.4(A:G)
N$6: R102.2 R103.2 R141.1
N$9: R106.1 R141.2 U46.3(+IN)
N$10: R108.1 U48.7(B:D) U48.8(B:D)
N$771: R104.1 R105.2 U46.4(-IN)
REG3V3: C105.1 R104.2 U46.5(V+) ; also sheet 2,13
REG5V: C109.1 C110.1 L2.2 R107.1 TP20.TP U47.7(FSW) U47.14(VOS) U48.3(A:S) ; also sheet 2
UVP5V_GATE: R106.2 TP14.TP U46.1(OUT) U48.2(B:G)
UVP5V_OUT: U48.5(A:D) U48.6(A:D) ; also sheet 5,7,8,9
VBATT: C104.1 C106.1 C107.1 R102.1 U47.10(AVIN) U47.11(PVIN) U47.12(PVIN) U47.13(EN) ; also sheet 1,5,7,8,9,10,11,12,13,17
Unconnected: U47.4(PG)

### Notes on the sheet
- 3A Buck Regulators
- Application circuits taken from TPS62130 Datasheet Fig. 44.
- FSW = High for 1.25MHz operation. Connect FSW to VOUT or PG.
- See Fig. 50 for layout
- TLV3491 bypass
- 5V Regulator and UVP

## Sheet 15 of 18: MCU and MUX
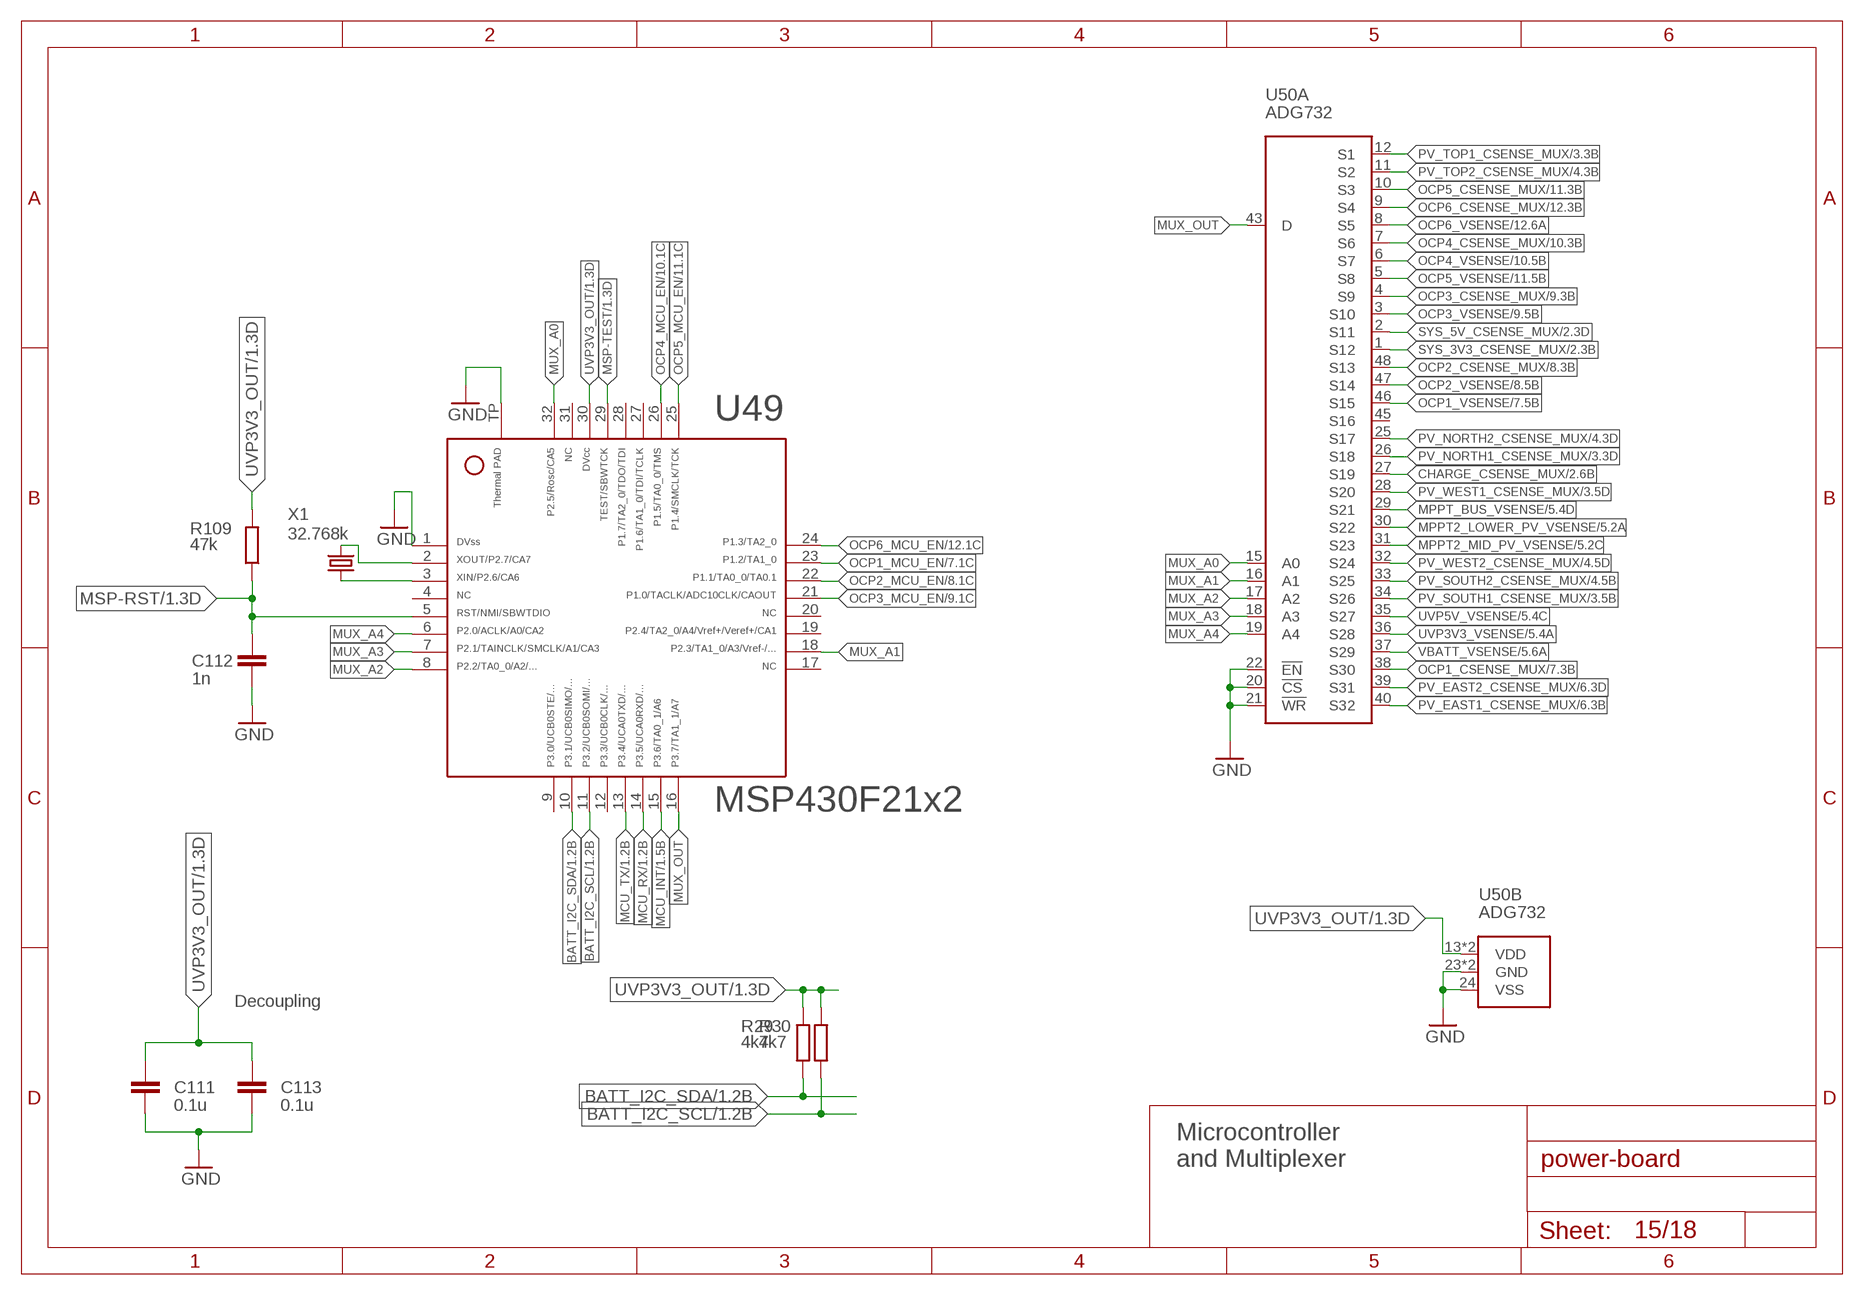
[diagram p14: schematic, sheet 15]

### Parts
C111  0.1u  C-EUC0603K  [C0603K]
C112  1n  C-EUC0603K  [C0603K]
C113  0.1u  C-EUC0603K  [C0603K]
R29  4k7  R-EU_R0603  [R0603]
R30  4k7  R-EU_R0603  [R0603]
R109  47k  R-EU_R0603  [R0603]
U49  MSP430F2132  F21X2---RHB32  [RHB32]
U50  ADG732  [LFCSP48]
X1  32.768k  XTAL-CC7V-T1A  [CC7V-T1A]

### Nets
BATT_I2C_SCL: R30.1 U49.11 ; also sheet 1
BATT_I2C_SDA: R29.1 U49.10 ; also sheet 1
CHARGE_CSENSE_MUX: U50.27(A:S19) ; also sheet 2
GND: C111.2 C112.2 C113.2 U49.1 U49.TP U50.20(A:!CS) U50.21(A:!WR) U50.22(A:!EN) U50.23(B:GND) U50.24(B:VSS) U50.EXP(B:GND) ; also sheet 1,2,3,4,5,6,7,8,9,10,11,12,13,14,16,18
MCU_INT: U49.15 ; also sheet 1
MCU_RX: U49.14 ; also sheet 1
MCU_TX: U49.13 ; also sheet 1
MPPT2_LOWER_PV_VSENSE: U50.30(A:S22) ; also sheet 5
MPPT2_MID_PV_VSENSE: U50.31(A:S23) ; also sheet 5
MPPT_BUS_VSENSE: U50.29(A:S21) ; also sheet 5
MSP-RST: C112.1 R109.1 U49.5 ; also sheet 1
MSP-TEST: U49.29 ; also sheet 1
MUX_A0: U49.32 U50.15(A:A0)
MUX_A1: U49.18 U50.16(A:A1)
MUX_A2: U49.8 U50.17(A:A2)
MUX_A3: U49.7 U50.18(A:A3)
MUX_A4: U49.6 U50.19(A:A4)
MUX_OUT: U49.16 U50.43(A:D)
N$33: U49.2 X1.P$2
N$35: U49.3 X1.P$1
OCP1_CSENSE_MUX: U50.38(A:S30) ; also sheet 7
OCP1_MCU_EN: U49.23 ; also sheet 7
OCP1_VSENSE: U50.46(A:S15) ; also sheet 7
OCP2_CSENSE_MUX: U50.48(A:S13) ; also sheet 8
OCP2_MCU_EN: U49.22 ; also sheet 8
OCP2_VSENSE: U50.47(A:S14) ; also sheet 8
OCP3_CSENSE_MUX: U50.4(A:S9) ; also sheet 9
OCP3_MCU_EN: U49.21 ; also sheet 9
OCP3_VSENSE: U50.3(A:S10) ; also sheet 9
OCP4_CSENSE_MUX: U50.7(A:S6) ; also sheet 10
OCP4_MCU_EN: U49.26 ; also sheet 10
OCP4_VSENSE: U50.6(A:S7) ; also sheet 10
OCP5_CSENSE_MUX: U50.10(A:S3) ; also sheet 11
OCP5_MCU_EN: U49.25 ; also sheet 11
OCP5_VSENSE: U50.5(A:S8) ; also sheet 11
OCP6_CSENSE_MUX: U50.9(A:S4) ; also sheet 12
OCP6_MCU_EN: U49.24 ; also sheet 12
OCP6_VSENSE: U50.8(A:S5) ; also sheet 12
PV_EAST1_CSENSE_MUX: U50.40(A:S32) ; also sheet 6
PV_EAST2_CSENSE_MUX: U50.39(A:S31) ; also sheet 6
PV_NORTH1_CSENSE_MUX: U50.26(A:S18) ; also sheet 3
PV_NORTH2_CSENSE_MUX: U50.25(A:S17) ; also sheet 4
PV_SOUTH1_CSENSE_MUX: U50.34(A:S26) ; also sheet 3
PV_SOUTH2_CSENSE_MUX: U50.33(A:S25) ; also sheet 4
PV_TOP1_CSENSE_MUX: U50.12(A:S1) ; also sheet 3
PV_TOP2_CSENSE_MUX: U50.11(A:S2) ; also sheet 4
PV_WEST1_CSENSE_MUX: U50.28(A:S20) ; also sheet 3
PV_WEST2_CSENSE_MUX: U50.32(A:S24) ; also sheet 4
SYS_3V3_CSENSE_MUX: U50.1(A:S12) ; also sheet 2
SYS_5V_CSENSE_MUX: U50.2(A:S11) ; also sheet 2
UVP3V3_OUT: C111.1 C113.1 R29.2 R30.2 R109.2 U49.30 U50.13(B:VDD) U50.14(B:VDD) ; also sheet 1,2,3,4,5,6,7,8,9,10,11,12,13
UVP3V3_VSENSE: U50.36(A:S28) ; also sheet 5
UVP5V_VSENSE: U50.35(A:S27) ; also sheet 5
VBATT_VSENSE: U50.37(A:S29) ; also sheet 5
Unconnected: U49.4 U49.9 U49.12 U49.17 U49.19 U49.20 U49.27 U49.28 U49.31 U50.45(A:S16)

### Notes on the sheet
- Decoupling
- Microcontroller
  and Multiplexer

## Sheet 16 of 18: MPPT
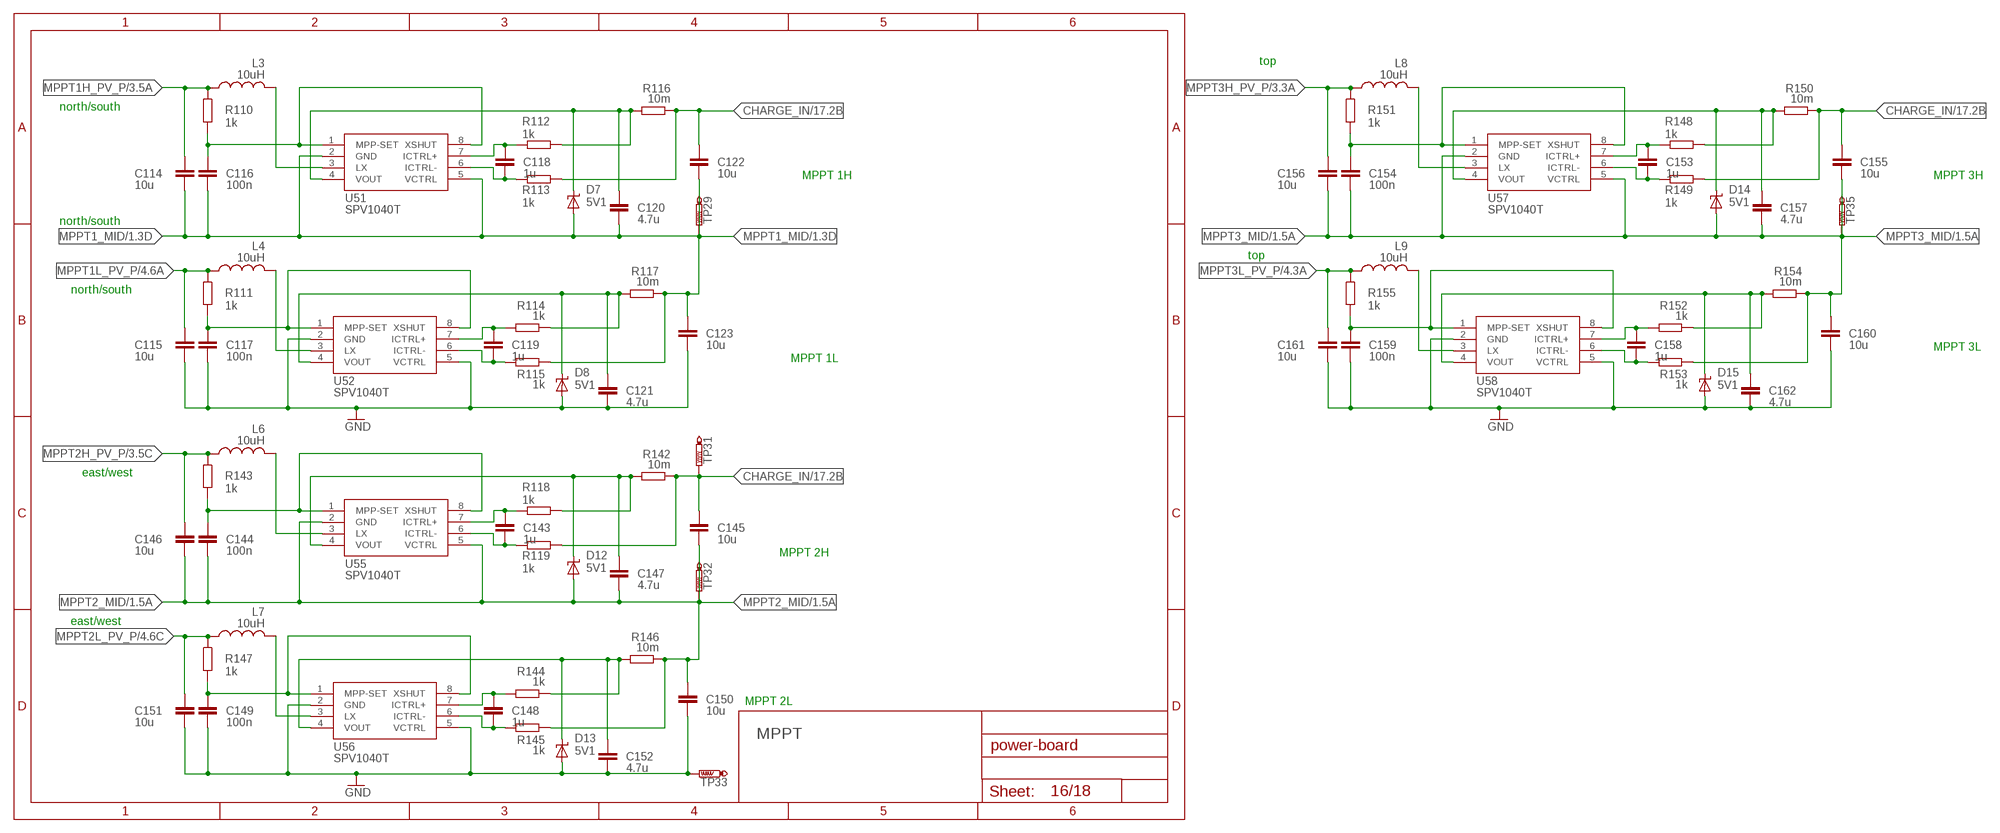
[diagram p15: schematic, sheet 16]

### Parts
C114  10u  C-EUC0805K  [C0805K]
C115  10u  C-EUC0805K  [C0805K]
C116  100n  C-EUC0603K  [C0603K]
C117  100n  C-EUC0603K  [C0603K]
C118  1u  C-EUC0603K  [C0603K]
C119  1u  C-EUC0603K  [C0603K]
C120  4.7u  C-EUC0805K  [C0805K]
C121  4.7u  C-EUC0805K  [C0805K]
C122  10u  C-EUC0805K  [C0805K]
C123  10u  C-EUC0805K  [C0805K]
C143  1u  C-EUC0603K  [C0603K]
C144  100n  C-EUC0603K  [C0603K]
C145  10u  C-EUC0805K  [C0805K]
C146  10u  C-EUC0805K  [C0805K]
C147  4.7u  C-EUC0805K  [C0805K]
C148  1u  C-EUC0603K  [C0603K]
C149  100n  C-EUC0603K  [C0603K]
C150  10u  C-EUC0805K  [C0805K]
C151  10u  C-EUC0805K  [C0805K]
C152  4.7u  C-EUC0805K  [C0805K]
C153  1u  C-EUC0603K  [C0603K]
C154  100n  C-EUC0603K  [C0603K]
C155  10u  C-EUC0805K  [C0805K]
C156  10u  C-EUC0805K  [C0805K]
C157  4.7u  C-EUC0805K  [C0805K]
C158  1u  C-EUC0603K  [C0603K]
C159  100n  C-EUC0603K  [C0603K]
C160  10u  C-EUC0805K  [C0805K]
C161  10u  C-EUC0805K  [C0805K]
C162  4.7u  C-EUC0805K  [C0805K]
D7  5V1  SUPPRESSOR-SMBJ  [SMBJ]
D8  5V1  SUPPRESSOR-SMBJ  [SMBJ]
D12  5V1  SUPPRESSOR-SMBJ  [SMBJ]
D13  5V1  SUPPRESSOR-SMBJ  [SMBJ]
D14  5V1  SUPPRESSOR-SMBJ  [SMBJ]
D15  5V1  SUPPRESSOR-SMBJ  [SMBJ]
L3  10uH  MSS7341  [MSS7341]
L4  10uH  MSS7341  [MSS7341]
L6  10uH  MSS7341  [MSS7341]
L7  10uH  MSS7341  [MSS7341]
L8  10uH  MSS7341  [MSS7341]
L9  10uH  MSS7341  [MSS7341]
R110  1k  R-EU_R0603  [R0603]
R111  1k  R-EU_R0603  [R0603]
R112  1k  R-EU_R0603  [R0603]
R113  1k  R-EU_R0603  [R0603]
R114  1k  R-EU_R0603  [R0603]
R115  1k  R-EU_R0603  [R0603]
R116  10m  R-EU_R1206  [R1206]
R117  10m  R-EU_R1206  [R1206]
R118  1k  R-EU_R0603  [R0603]
R119  1k  R-EU_R0603  [R0603]
R142  10m  R-EU_R1206  [R1206]
R143  1k  R-EU_R0603  [R0603]
R144  1k  R-EU_R0603  [R0603]
R145  1k  R-EU_R0603  [R0603]
R146  10m  R-EU_R1206  [R1206]
R147  1k  R-EU_R0603  [R0603]
R148  1k  R-EU_R0603  [R0603]
R149  1k  R-EU_R0603  [R0603]
R150  10m  R-EU_R1206  [R1206]
R151  1k  R-EU_R0603  [R0603]
R152  1k  R-EU_R0603  [R0603]
R153  1k  R-EU_R0603  [R0603]
R154  10m  R-EU_R1206  [R1206]
R155  1k  R-EU_R0603  [R0603]
TP29  PTR1TP09R  [TP09R]
TP31  PTR1TP09R  [TP09R]
TP32  PTR1TP09R  [TP09R]
TP33  PTR1TP09R  [TP09R]
TP35  PTR1TP09R  [TP09R]
U51  SPV1040T  [TSSOP8]
U52  SPV1040T  [TSSOP8]
U55  SPV1040T  [TSSOP8]
U56  SPV1040T  [TSSOP8]
U57  SPV1040T  [TSSOP8]
U58  SPV1040T  [TSSOP8]

### Nets
CHARGE_IN: C122.1 C145.1 C155.1 R113.1 R116.1 R119.1 R142.1 R149.1 R150.1 TP31.TP ; also sheet 1,5,17,18
GND: C115.2 C117.2 C121.2 C123.2 C149.2 C150.2 C151.2 C152.2 C159.2 C160.2 C161.2 C162.2 D8.A D13.A D15.A TP33.TP U52.2(GND) U52.5(VCTRL) U56.2(GND) U56.5(VCTRL) U58.2(GND) U58.5(VCTRL) ; also sheet 1,2,3,4,5,6,7,8,9,10,11,12,13,14,15,18
MPPT1_MID: C114.2 C116.2 C120.2 C122.2 C123.1 D7.A R115.1 R117.1 TP29.TP U51.2(GND) U51.5(VCTRL) ; also sheet 1
MPPT1H_PV_P: C114.1 L3.1 R110.1 ; also sheet 3
MPPT1L_PV_P: C115.1 L4.1 R111.1 ; also sheet 4
MPPT2_MID: C144.2 C145.2 C146.2 C147.2 C150.1 D12.A R145.1 R146.1 TP32.TP U55.2(GND) U55.5(VCTRL) ; also sheet 1,5
MPPT2H_PV_P: C146.1 L6.1 R143.1 ; also sheet 3,6
MPPT2L_PV_P: C151.1 L7.1 R147.1 ; also sheet 4,5,6
MPPT3_MID: C154.2 C155.2 C156.2 C157.2 C160.1 D14.A R153.1 R154.1 TP35.TP U57.2(GND) U57.5(VCTRL) ; also sheet 1
MPPT3H_PV_P: C156.1 L8.1 R151.1 ; also sheet 3
MPPT3L_PV_P: C161.1 L9.1 R155.1 ; also sheet 4
N$39: C118.1 R112.2 U51.7(ICTRL+)
N$40: C118.2 R113.2 U51.6(ICTRL-)
N$41: C120.1 D7.C R112.1 R116.2 U51.4(VOUT)
N$44: C116.1 R110.2 U51.1(MPP-SET) U51.8(XSHUT)
N$45: L3.2 U51.3(LX)
N$89: C143.1 R118.2 U55.7(ICTRL+)
N$91: C143.2 R119.2 U55.6(ICTRL-)
N$92: C147.1 D12.C R118.1 R142.2 U55.4(VOUT)
N$277: C119.1 R114.2 U52.7(ICTRL+)
N$278: C119.2 R115.2 U52.6(ICTRL-)
N$283: C121.1 D8.C R114.1 R117.2 U52.4(VOUT)
N$286: C117.1 R111.2 U52.1(MPP-SET) U52.8(XSHUT)
N$287: L4.2 U52.3(LX)
N$778: C144.1 R143.2 U55.1(MPP-SET) U55.8(XSHUT)
N$779: L6.2 U55.3(LX)
N$780: C148.1 R144.2 U56.7(ICTRL+)
N$781: C148.2 R145.2 U56.6(ICTRL-)
N$782: C152.1 D13.C R144.1 R146.2 U56.4(VOUT)
N$783: C149.1 R147.2 U56.1(MPP-SET) U56.8(XSHUT)
N$784: L7.2 U56.3(LX)
N$785: C153.1 R148.2 U57.7(ICTRL+)
N$786: C153.2 R149.2 U57.6(ICTRL-)
N$787: C157.1 D14.C R148.1 R150.2 U57.4(VOUT)
N$788: C154.1 R151.2 U57.1(MPP-SET) U57.8(XSHUT)
N$789: L8.2 U57.3(LX)
N$790: C158.1 R152.2 U58.7(ICTRL+)
N$791: C158.2 R153.2 U58.6(ICTRL-)
N$792: C162.1 D15.C R152.1 R154.2 U58.4(VOUT)
N$793: C159.1 R155.2 U58.1(MPP-SET) U58.8(XSHUT)
N$794: L9.2 U58.3(LX)

### Notes on the sheet
- top
- north/south
- MPPT 1H | MPPT 3H
- north/south
- top
- north/south
- MPPT 3L
- MPPT 1L
- east/west
- MPPT 2H
- east/west
- MPPT 2L
- MPPT

## Sheet 17 of 18: Deployment
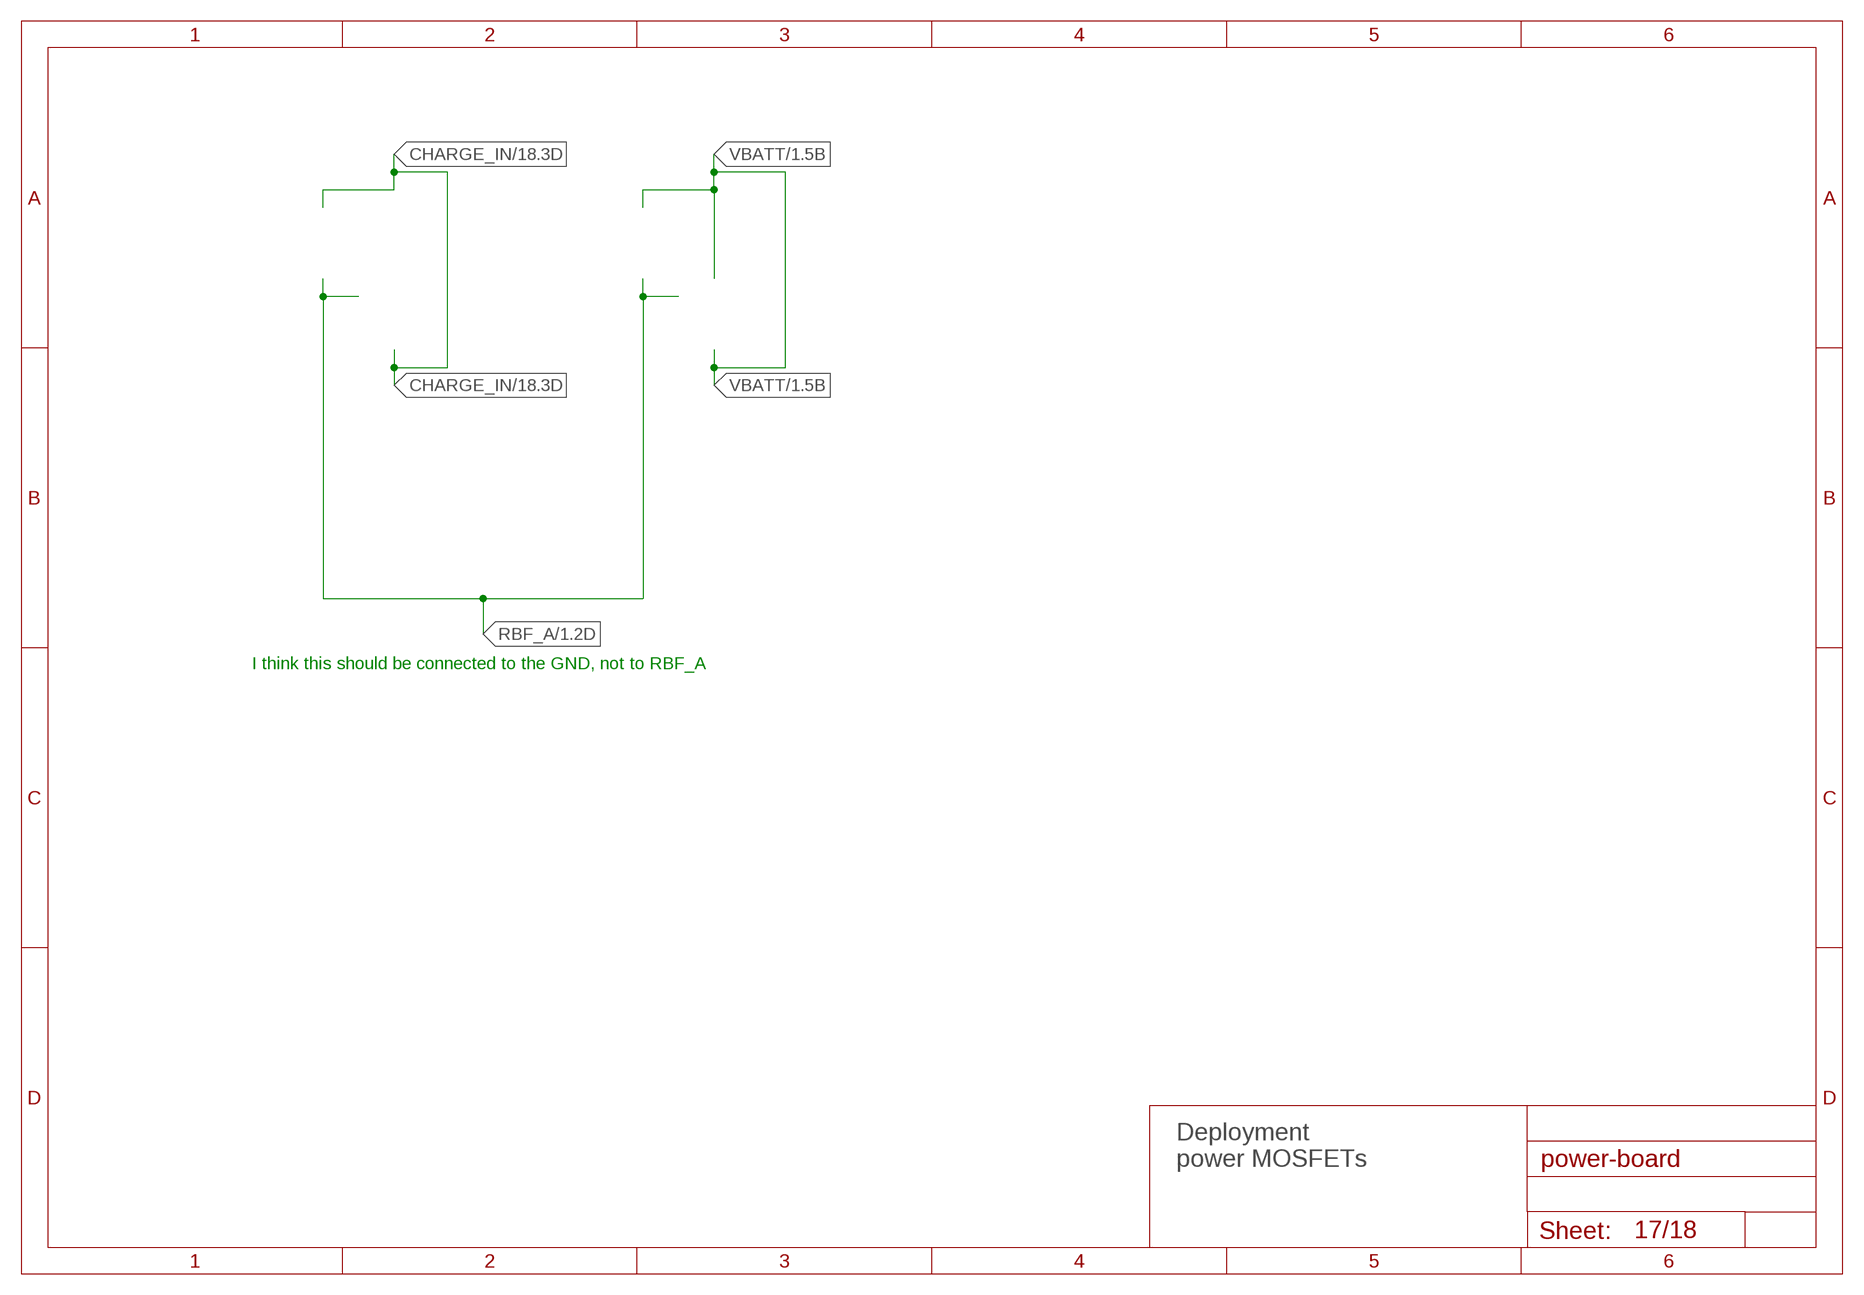
[diagram p16: schematic, sheet 17]

### Notes on the sheet
- I think this should be connected to the GND, not to RBF_A
- Deployment
  power MOSFETs

## Sheet 18 of 18: Battery Charger
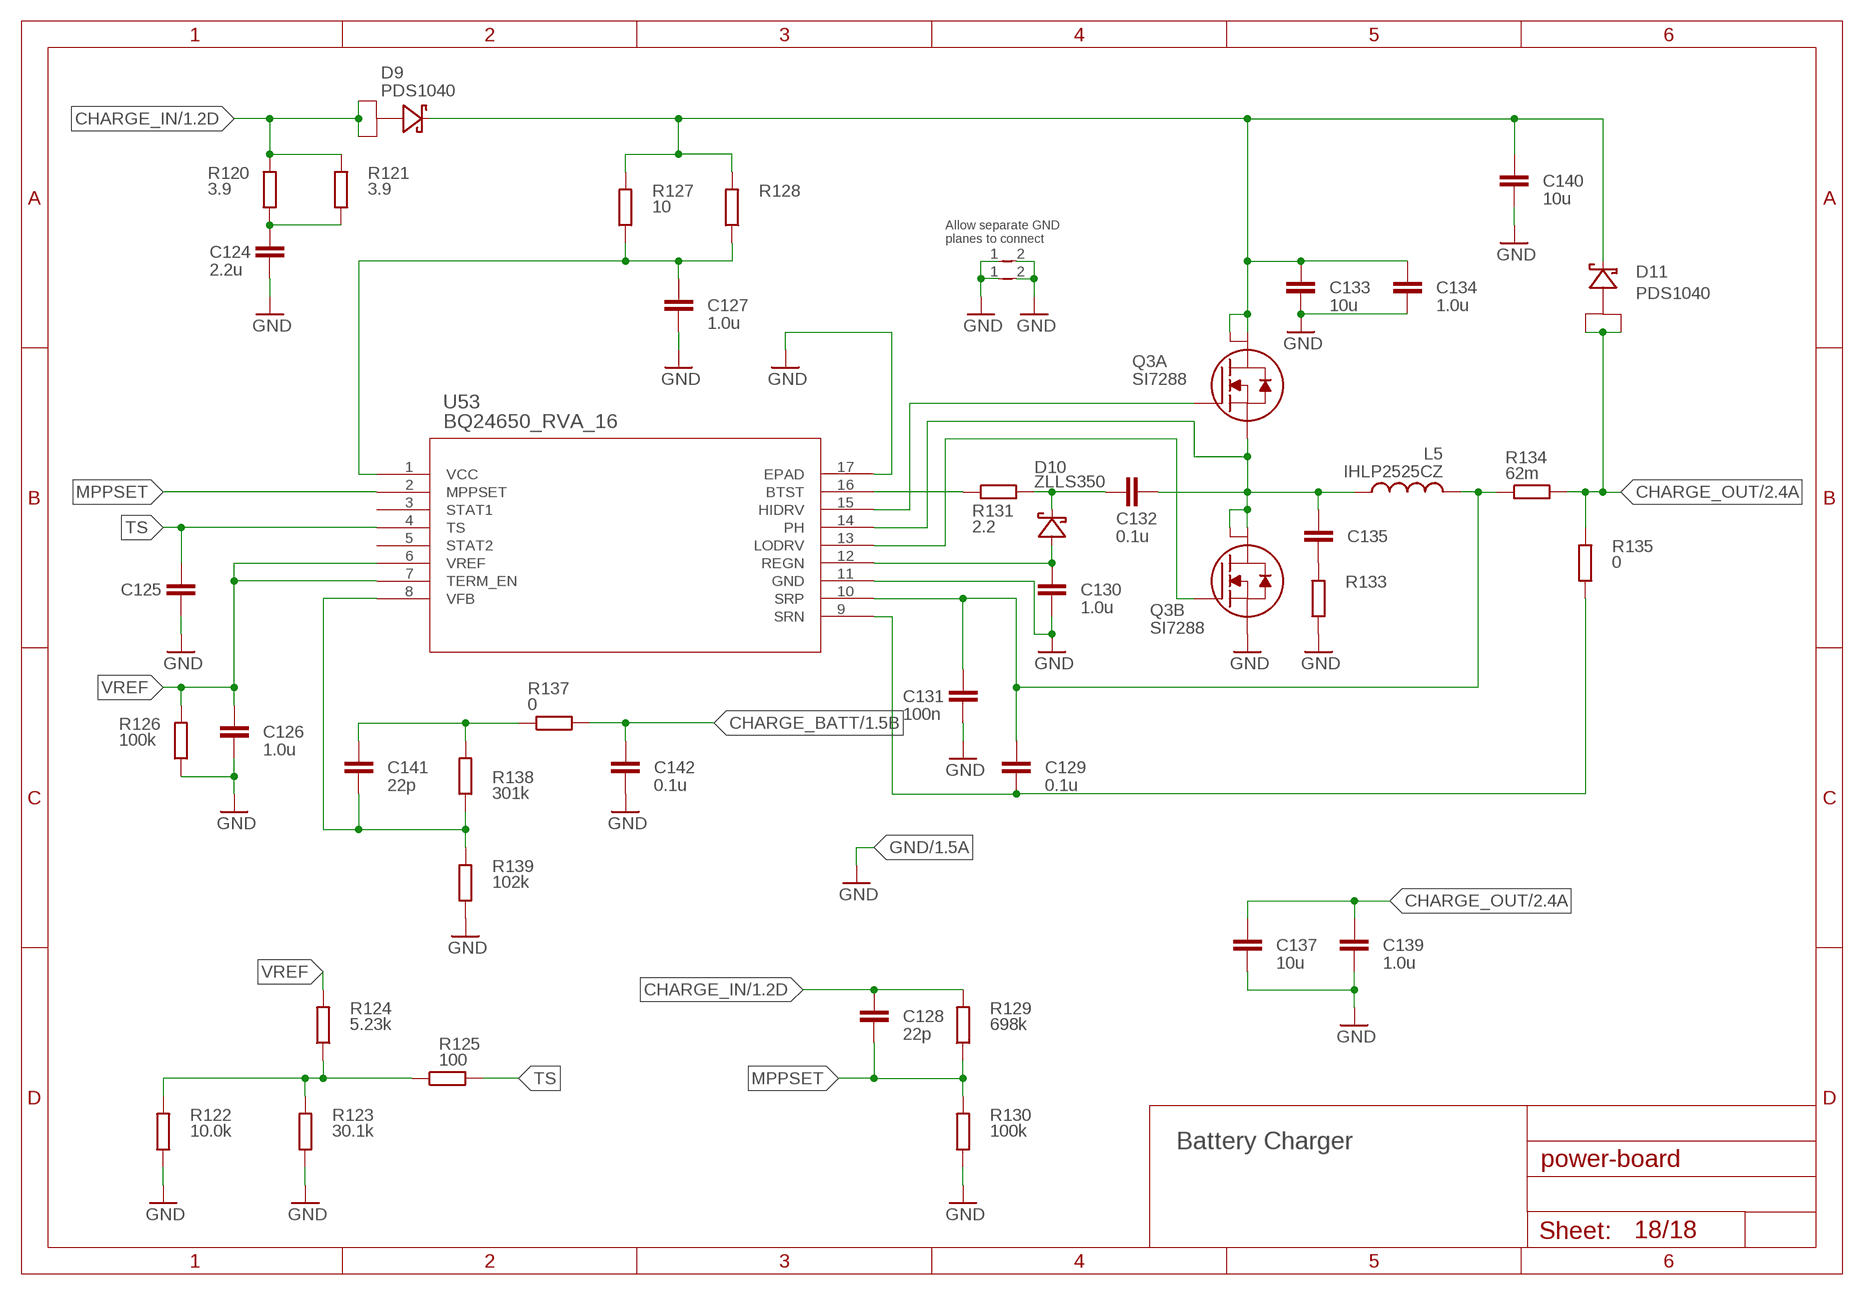
[diagram p17: schematic, sheet 18]

### Parts
C124  2.2u  C-EUC1210  [C1210]
C125  C0603  [P0603]
C126  1.0u  C0805  [P0805]
C127  1.0u  C0805  [P0805]
C128  22p  C0603  [P0603]
C129  0.1u  C0603  [P0603]
C130  1.0u  C0805  [P0805]
C131  100n  C0603  [P0603]
C132  0.1u  C0603  [P0603]
C133  10u  C-EUC1210  [C1210]
C134  1.0u  C-EUC0805  [C0805]
C135  C-EUC0603  [C0603]
C137  10u  C1210  [P1210]
C139  1.0u  C0805  [P0805]
C140  10u  C-EUC1210  [C1210]
C141  22p  C0603  [P0603]
C142  0.1u  C0603  [P0603]
D9  PDS1040  [POWERDI5]
D10  ZLLS350  [SOD-523]
D11  PDS1040  [POWERDI5]
L5  IHLP2525CZ  [IHLP2525CZ]
Q3  SI7288  [SO8-POWERPAK_DUAL]
R120  3.9  R-EU_R0603  [R0603]
R121  3.9  R-EU_R0603  [R0603]
R122  10.0k  R0603  [P0603]
R123  30.1k  R0603  [P0603]
R124  5.23k  R0603  [P0603]
R125  100  R0603  [P0603]
R126  100k  R0603  [P0603]
R127  10  R0805  [P0805]
R128  R0805  [P0805]
R129  698k  R0603  [P0603]
R130  100k  R0603  [P0603]
R131  2.2  R0603  [P0603]
R133  R0805  [P0805]
R134  62m  R-EU_R1206  [R1206]
R135  0  R0603  [P0603]
R137  0  R0603  [P0603]
R138  301k  R0603  [P0603]
R139  102k  R0603  [P0603]
SH1  SHORT  [SHORT]
SH2  SHORT  [SHORT]
U53  BQ24650_RVA_16  [RVA16_2P14X2P14]

### Nets
CHARGE_BATT: C142.1 R137.2 ; also sheet 1,2
CHARGE_IN: C128.1 D9.LEFT(A1) D9.RIGHT(A2) R120.2 R121.2 R129.2 ; also sheet 1,5,16,17
CHARGE_OUT: C137.1 C139.1 D11.LEFT(A1) D11.RIGHT(A2) R134.2 R135.2 ; also sheet 2
GND: C124.2 C125.2 C126.2 C127.1 C130.2 C131.2 C133.2 C134.2 C137.2 C139.2 C140.2 C142.2 Q3.3(B:S) R122.1 R123.1 R126.1 R130.1 R133.1 R139.1 SH1.1 SH1.2 SH2.1 SH2.2 U53.11(GND) U53.17(EPAD) ; also sheet 1,2,3,4,5,6,7,8,9,10,11,12,13,14,15,16
MPPSET: C128.2 R129.1 R130.2 U53.2(MPPSET)
N$756: C141.1 R137.1 R138.2
N$757: C124.1 R120.1 R121.1
N$758: C135.2 R133.2
N$759: C127.2 R127.1 R128.1 U53.1(VCC)
N$760: C130.1 D10.2(A) U53.12(REGN)
N$761: C129.1 C131.1 L5.2 R134.1 U53.10(SRP)
N$762: C129.2 R135.1 U53.9(SRN)
N$763: C132.2 C135.1 L5.1 Q3.1(A:S) Q3.5(B:D2) Q3.PAD56(B:D) U53.14(PH)
N$764: C132.1 D10.1(C) R131.2
N$765: R131.1 U53.16(BTST)
N$766: C141.2 R138.1 R139.2 U53.8(VFB)
N$768: R122.2 R123.2 R124.1 R125.1
N$769: Q3.2(A:G) U53.15(HIDRV)
N$770: Q3.4(B:G) U53.13(LODRV)
PROP: C133.1 C134.1 C140.1 D9.HEAT_SINK(C) D11.HEAT_SINK(C) Q3.8(A:D2) Q3.PAD78(A:D) R127.2 R128.2
TS: C125.1 R125.2 U53.4(TS)
VREF: C126.1 R124.2 R126.2 U53.6(VREF) U53.7(TERM_EN)
Unconnected: U53.3(STAT1) U53.5(STAT2)

### Notes on the sheet
- Allow separate GND
  planes to connect
- Battery Charger

## Library data of the parts
C1-C26 C28-C124 C133-C136 C138 C140 C143-C162 = rcl:C-EU: CAPACITOR, European symbol
C125-C132 C137 C139 C141 C142 = BatteryCharger:C: CAPACITOR
D1-D6 = tomparts:PMEG2005AEA
D7 D8 D12-D15 = diode:SUPPRESSOR-: Suppressor diode
D9 D11 = BatteryCharger:PDS1040: 10A SCHOTTKY BARRIER RECTIFIER
D10 = BatteryCharger:ZLLS350
FID1-FID4 = fiducial:FIDUCIAL: Fiducial Alignment Points Various fiducial points for machine vision alignment.
J1 J2 = ti-tiva:FE26-2
J6 = con-hirose-df13:DF13-8P-1.25: DF13-8P 1.25mm Pitch Miniature Crimping Connector.
J7 = con-hirose-df13:DF13-10P-1.25: DF13-10P 1.25mm Pitch Miniature Crimping Connector.
J8 J9 = con-hirose-df13:DF13-4P-1.25: DF13-4P 1.25mm Pitch Miniature Crimping Connector.
L1 L2 = gdp_pss_library:VISHAY-INDUCTOR
L3 L4 L6-L9 = gdp_pss_library:MSS7341: Shielded Power Inductors Package 6.6 × 6.6 mm x 4.1 mm high Source: http://www.farnell.com/datasheets/1681958.pdf
L5 = BatteryCharger:IHLP2525CZ: Low-Profile, High-Current IHLP Inductor
Q3 = BatteryCharger:SI7288: Dual N-Channel 40-V (D-S) MOSFET
R1-R121 R132 R134 R136 R140-R155 = rcl:R-EU_: RESISTOR, European symbol
R122-R131 R133 R135 R137-R139 = BatteryCharger:R: RESISTOR
SH1 SH2 = BatteryCharger:SHORT: Short for seperate ground planes
TP1-TP27 TP29 TP31-TP33 TP35 = testpad:PTR1: TEST PIN
U1-U12 U14 U19 U24 U29 U34 U39 U54 = gdp_pss_library:INA214
U13 U18 U23 U28 U33 U38 = tomparts:MCP6561
U15 U20 U25 U30 U35 = tomparts:SN74AUP1G00: 2-Input NAND Gate
U16 U21 U26 U31 U36 U41 = tomparts:SN74LVC1G373: D-Type Latch With 3-State Output
U17 U22 U27 U32 U37 = gdp_pss_library:NTHD4508N: Dual N-Channel Power MOSFET
U40 = gdp_pss_library:SN74AUP1T08: 2-Input AND Gate
U42 U45 U48 = gdp_pss_library:FDS8858CZ: Dual N & P power MOSFET
U43 U46 = tomparts:TLV3491: Comparator, nanopower, push-pull output
U44 = gdp_pss_library:TPS62132: 3.3V, 3A Buck Regulator
U47 = gdp_pss_library:TPS62133: 5V, 3A Buck Regulator
U49 = TI_MSP430_v16:F21X2---RHB32: *** MSP430F21x2 *** RHB32
U50 = gdp_pss_library:ADG732: 32-channel analogue multiplexer
U51 U52 U55-U58 = gdp_pss_library:SPV1040: Solar maximum power point tracker/battery charger
U53 = BatteryCharger:BQ24650_RVA_16; DATASHEETURL: http://www.ti.com/lit/gpn/BQ24650; DESCRIPTION: High Efficiency Synchronous Switch-Mode Charger Controller  Solar Battery Charger; FAMILY_NAME: BATTERY CHARGE MANAGEMENT; GENERIC_PART_NUMBER: BQ24650; INDUSTRY_STD_PKG_TYPE: VQFN; MANUFACTURER: Texas Instruments; PACKAGE_DESIGNATOR: RVA; PIN_COUNT: 16
X1 = gdp_pss_library:XTAL-CC7V-T1A: SMD Crystal